# EAGLE design ATMEGA版メイン基板 (EAGLE 9.6.2)
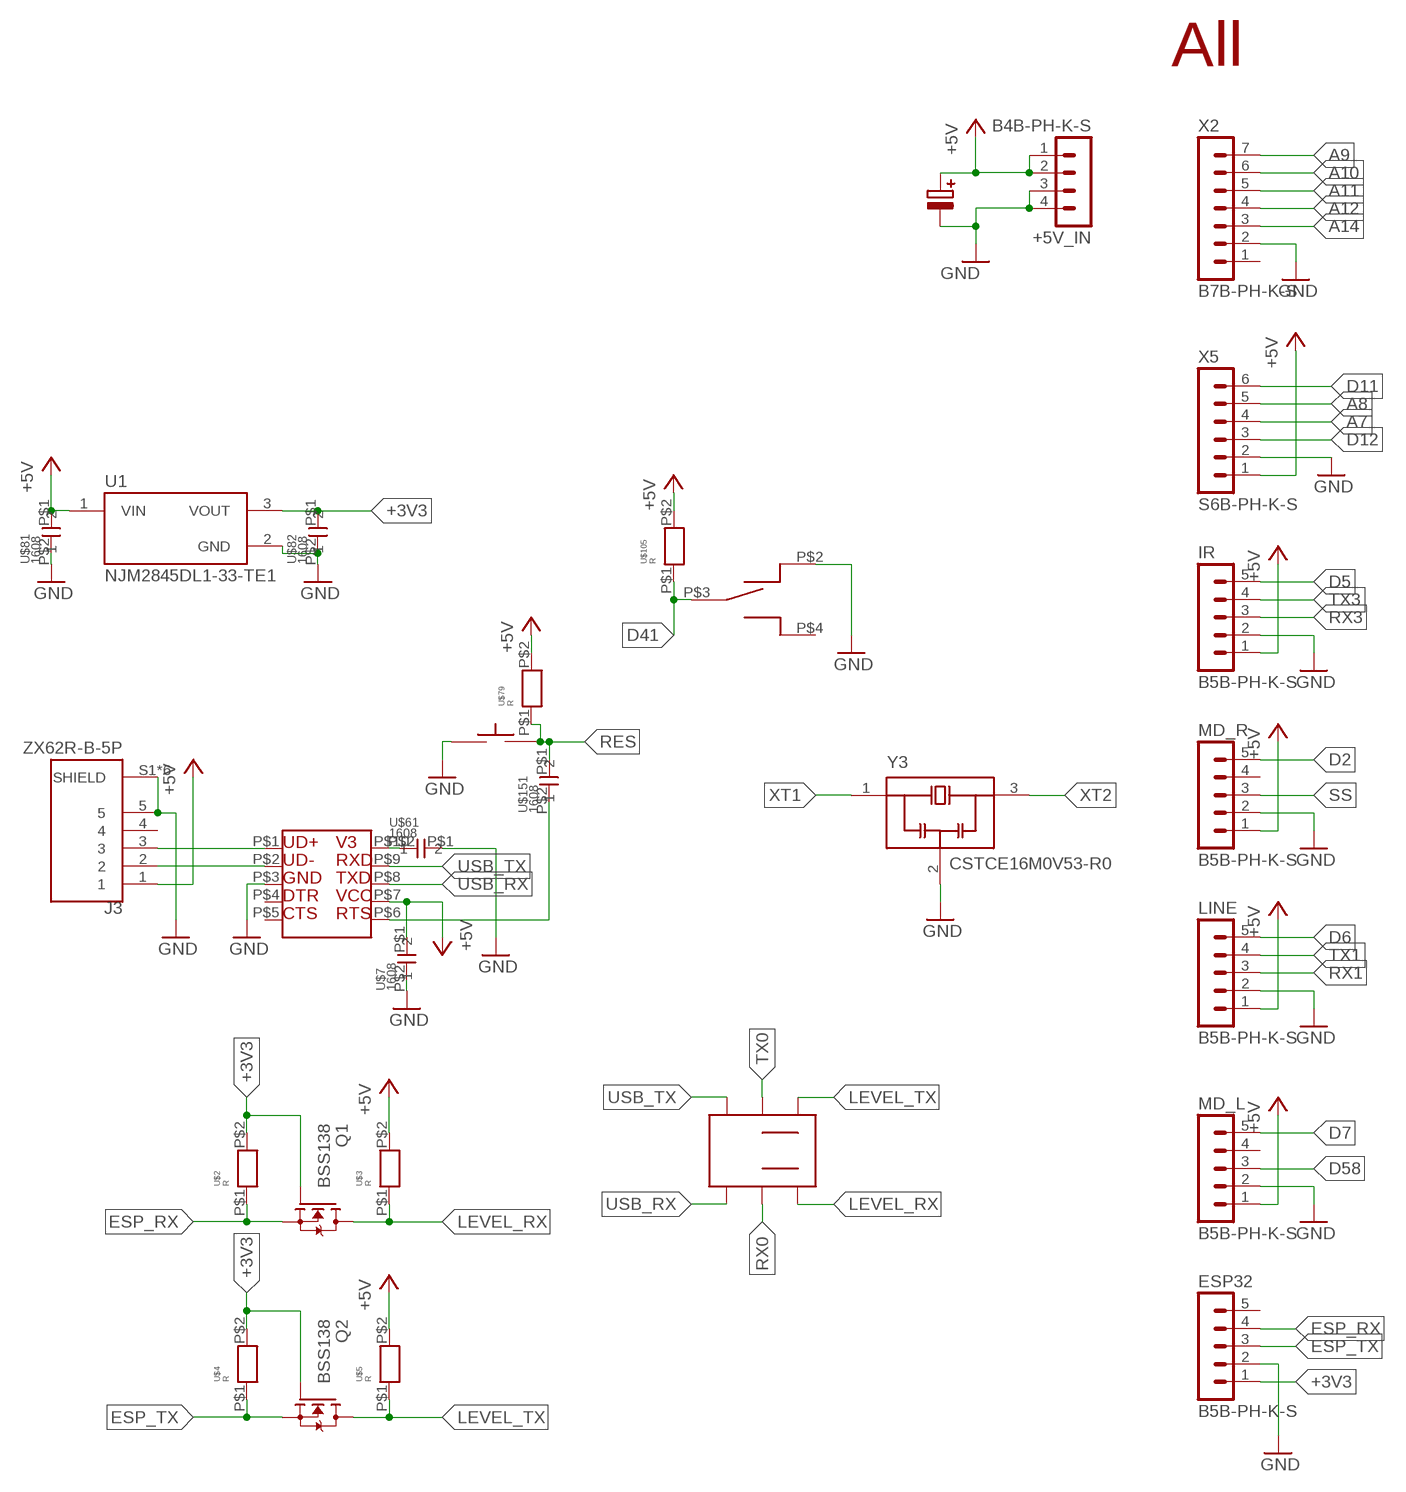
[diagram p0: schematic, sheet 1, part 1 of 2]
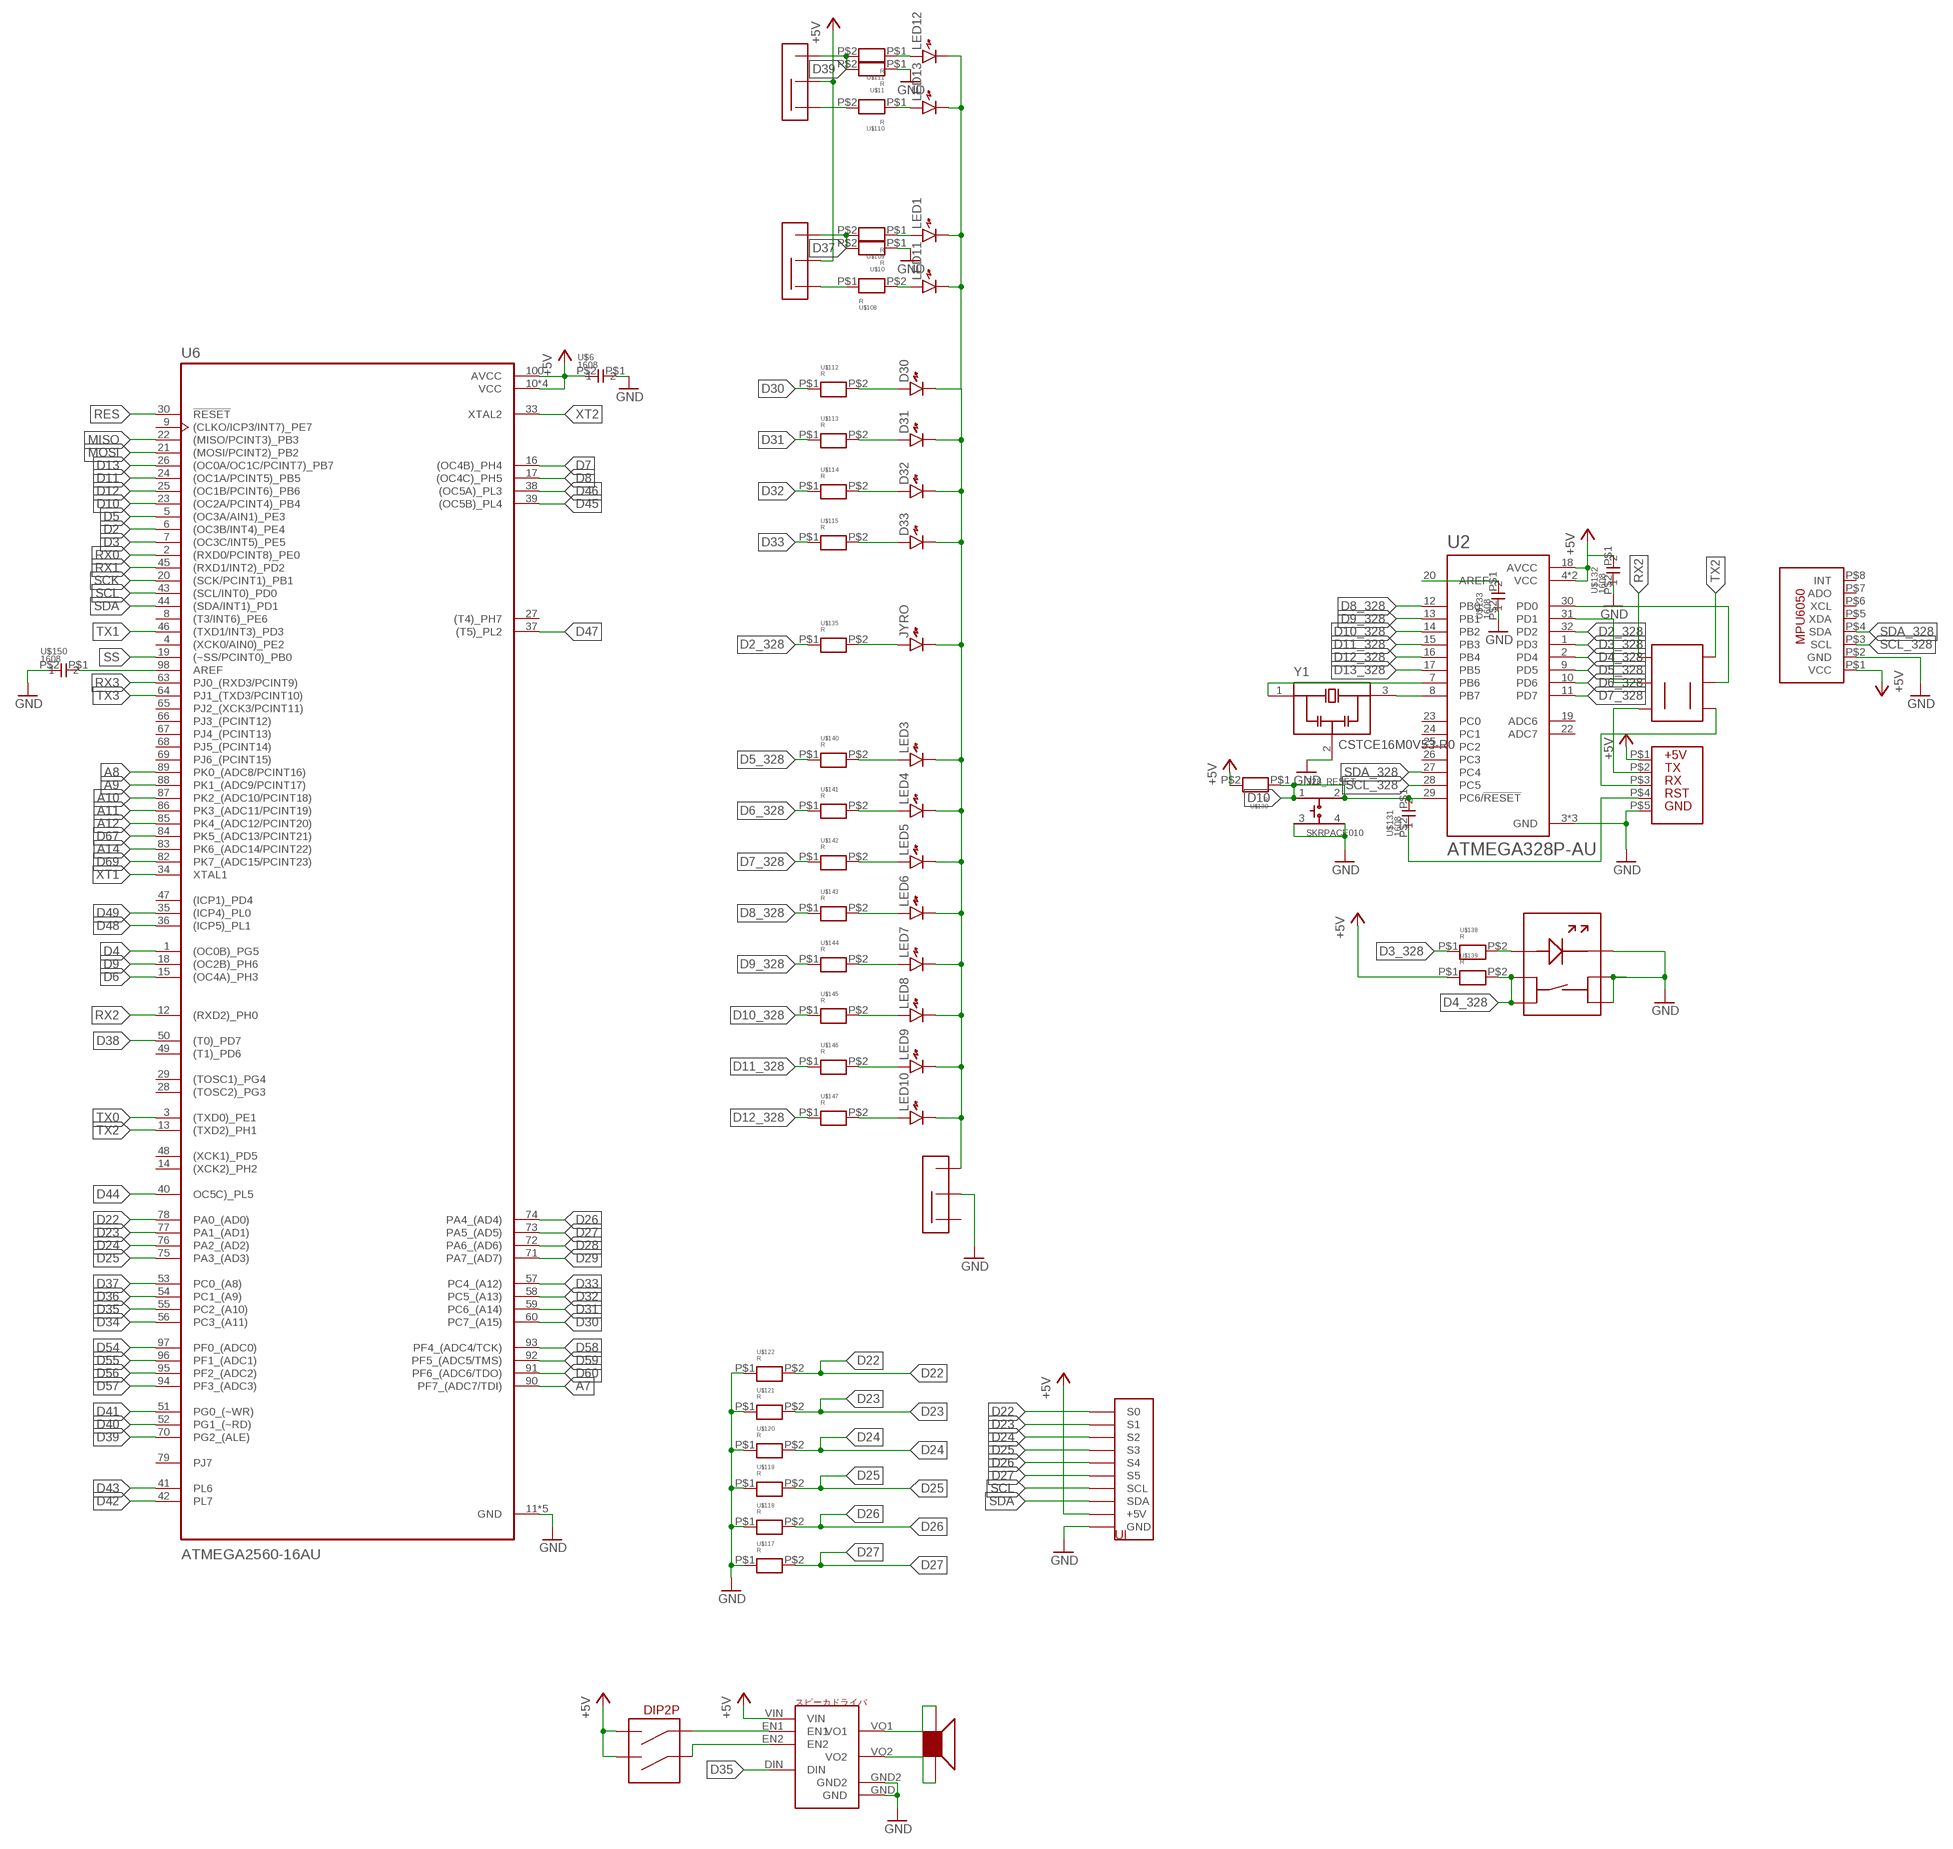
[diagram p1: schematic, sheet 1, part 2 of 2]

## Parts
328_RESET  SKRPACE010  [SW_SKRPACE010]
+5V_IN  B4B-PH-K-S  [B4B-PH-K-S]
D30  LED1608  [LED1608]
D31  LED1608  [LED1608]
D32  LED1608  [LED1608]
D33  LED1608  [LED1608]
ESP32  B5B-PH-K-S  [B5B-PH-K-S]
IR  B5B-PH-K-S  [B5B-PH-K-S]
J3  ZX62R-B-5P  [HRS_ZX62R-B-5P]
JYRO  LED1608  [LED1608]
LED1  LED1608  [LED1608]
LED3  LED1608  [LED1608]
LED4  LED1608  [LED1608]
LED5  LED1608  [LED1608]
LED6  LED1608  [LED1608]
LED7  LED1608  [LED1608]
LED8  LED1608  [LED1608]
LED9  LED1608  [LED1608]
LED10  LED1608  [LED1608]
LED11  LED1608  [LED1608]
LED12  LED1608  [LED1608]
LED13  LED1608  [LED1608]
LINE  B5B-PH-K-S  [B5B-PH-K-S]
MD_L  B5B-PH-K-S  [B5B-PH-K-S]
MD_R  B5B-PH-K-S  [B5B-PH-K-S]
Q1  BSS138  [SOT23]
Q2  BSS138  [SOT23]
U1  NJM2845DL1-33-TE1  [DPAK228P968X238-4N]
U2  ATMEGA328P-AU  [QFP80P900X900X120-32N]
U6  ATMEGA2560-16AU  [QFP50P1600X1600X120-100N]
U$1  25V100  [25V100]
U$2  R  [1608]
U$3  R  [1608]
U$4  R  [1608]
U$5  R  [1608]
U$6  1608  [CON]
U$7  1608  [CON]
U$8  2SW  [2SW]
U$9  S  [S]
U$10  R  [1608]
U$11  R  [1608]
U$12  BUZA-  [ぶざー]
U$13  BUZA_DR  [BUZA_DR]
U$14  DIP2  [DIP2]
U$46  CH340K  [CH340K]
U$61  1608  [CON]
U$79  R  [1608]
U$80  TAKUTO  [12]
U$81  1608  [CON]
U$82  1608  [CON]
U$93  ジャイロ  [ジャイロ]
U$105  R  [1608]
U$106  SSW  [SSW]
U$107  SSW  [SSW]
U$108  R  [1608]
U$109  R  [1608]
U$110  R  [1608]
U$111  R  [1608]
U$112  R  [1608]
U$113  R  [1608]
U$114  R  [1608]
U$115  R  [1608]
U$117  R  [1608]
U$118  R  [1608]
U$119  R  [1608]
U$120  R  [1608]
U$121  R  [1608]
U$122  R  [1608]
U$130  R  [1608]
U$131  1608  [CON]
U$132  1608  [CON]
U$133  1608  [CON]
U$134  SI  [SI]
U$135  R  [1608]
U$136  2SW  [2SW]
U$137  SWLED  [SWLED]
U$138  R  [1608]
U$139  R  [1608]
U$140  R  [1608]
U$141  R  [1608]
U$142  R  [1608]
U$143  R  [1608]
U$144  R  [1608]
U$145  R  [1608]
U$146  R  [1608]
U$147  R  [1608]
U$148  SSW  [SSW]
U$149  UI  [UI]
U$150  1608  [CON]
U$151  1608  [CON]
U$152  ALL  [ALL]
X2  B7B-PH-K-S  [B7B-PH-K-S]
X5  S6B-PH-K-S  [S6B-PH-K-S]
Y1  CSTCE16M0V53-R0  [OSC_CSTCE16M0V53-R0]
Y3  CSTCE16M0V53-R0  [OSC_CSTCE16M0V53-R0]

## Nets
+3V3: ESP32.1 Q1.1(G) Q2.1(G) U1.3(VOUT) U$2.P$2 U$4.P$2 U$82.P$1
+5V: +5V_IN.1 +5V_IN.2 IR.1 J3.1 LINE.1 MD_L.1 MD_R.1 U1.1(VIN) U2.4(VCC) U2.6(VCC) U2.18(AVCC) U6.10(VCC) U6.31(VCC) U6.61(VCC) U6.80(VCC) U6.100(AVCC) U$1.P$1 U$3.P$2 U$5.P$2 U$6.P$2 U$7.P$1 U$13.VIN U$14.P$15 U$14.P$16 U$46.P$7 U$79.P$2 U$81.P$1 U$93.P$1(VCC) U$105.P$2 U$106.P$3 U$107.P$3 U$130.P$2 U$132.P$1 U$134.P$1 U$139.P$1 U$149.P$1(+5V) X5.1
A7: U6.90(PF7_(ADC7/TDI)) X5.4
A8: U6.89(PK0_(ADC8/PCINT16)) X5.5
A9: U6.88(PK1_(ADC9/PCINT17)) X2.7
A10: U6.87(PK2_(ADC10/PCINT18)) X2.6
A11: U6.86(PK3_(ADC11/PCINT19)) X2.5
A12: U6.85(PK4_(ADC12/PCINT20)) X2.4
A14: U6.83(PK6_(ADC14/PCINT22)) X2.3
D2: MD_R.5 U6.6((OC3B/INT4)_PE4)
D2_328: U2.32(PD2) U$135.P$1
D3: U6.7((OC3C/INT5)_PE5)
D3_328: U2.1(PD3) U$138.P$1
D4: U6.1((OC0B)_PG5)
D4_328: U2.2(PD4) U$137.1 U$137.2 U$139.P$2
D5: IR.5 U6.5((OC3A/AIN1)_PE3)
D5_328: U2.9(PD5) U$140.P$1
D6: LINE.5 U6.15((OC4A)_PH3)
D6_328: U2.10(PD6) U$141.P$1
D7: MD_L.5 U6.16((OC4B)_PH4)
D7_328: U2.11(PD7) U$142.P$1
D8: U6.17((OC4C)_PH5)
D8_328: U2.12(PB0) U$143.P$1
D9: U6.18((OC2B)_PH6)
D9_328: U2.13(PB1) U$144.P$1
D10: 328_RESET.1 328_RESET.2 U2.29(PC6/!RESET) U6.23((OC2A/PCINT4)_PB4) U$130.P$1 U$131.P$1
D10_328: U2.14(PB2) U$145.P$1
D11: U6.24((OC1A/PCINT5)_PB5) X5.6
D11_328: U2.15(PB3) U$146.P$1
D12: U6.25((OC1B/PCINT6)_PB6) X5.3
D12_328: U2.16(PB4) U$147.P$1
D13: U6.26((OC0A/OC1C/PCINT7)_PB7)
D13_328: U2.17(PB5)
D22: U6.78(PA0_(AD0)) U$122.P$2 U$149.P$3(S0)
D23: U6.77(PA1_(AD1)) U$121.P$2 U$149.P$4(S1)
D24: U6.76(PA2_(AD2)) U$120.P$2 U$149.P$5(S2)
D25: U6.75(PA3_(AD3)) U$119.P$2 U$149.P$6(S3)
D26: U6.74(PA4_(AD4)) U$118.P$2 U$149.P$7(S4)
D27: U6.73(PA5_(AD5)) U$117.P$2 U$149.P$8(S5)
D28: U6.72(PA6_(AD6))
D29: U6.71(PA7_(AD7))
D30: U6.60(PC7_(A15)) U$112.P$1
D31: U6.59(PC6_(A14)) U$113.P$1
D32: U6.58(PC5_(A13)) U$114.P$1
D33: U6.57(PC4_(A12)) U$115.P$1
D34: U6.56(PC3_(A11))
D35: U6.55(PC2_(A10)) U$13.DIN
D36: U6.54(PC1_(A9))
D37: U6.53(PC0_(A8)) U$10.P$2 U$106.P$2 U$109.P$2
D38: U6.50((T0)_PD7)
D39: U6.70(PG2_(ALE)) U$11.P$2 U$107.P$2 U$111.P$2
D40: U6.52(PG1_(~RD))
D41: U6.51(PG0_(~WR)) U$9.P$3 U$105.P$1
D42: U6.42(PL7)
D43: U6.41(PL6)
D44: U6.40(OC5C)_PL5)
D45: U6.39((OC5B)_PL4)
D46: U6.38((OC5A)_PL3)
D47: U6.37((T5)_PL2)
D48: U6.36((ICP5)_PL1)
D49: U6.35((ICP4)_PL0)
D54: U6.97(PF0_(ADC0))
D55: U6.96(PF1_(ADC1))
D56: U6.95(PF2_(ADC2))
D57: U6.94(PF3_(ADC3))
D58: MD_L.3 U6.93(PF4_(ADC4/TCK))
D59: U6.92(PF5_(ADC5/TMS))
D60: U6.91(PF6_(ADC6/TDO))
D67: U6.84(PK5_(ADC13/PCINT21))
D69: U6.82(PK7_(ADC15/PCINT23))
ESP_RX: ESP32.4 Q1.2(S) U$2.P$1
ESP_TX: ESP32.3 Q2.2(S) U$4.P$1
GND: 328_RESET.3 328_RESET.4 +5V_IN.3 +5V_IN.4 ESP32.2 IR.2 J3.5 J3.S1(SHIELD) J3.S2(SHIELD) J3.S3(SHIELD) J3.S4(SHIELD) J3.S5(SHIELD) J3.S6(SHIELD) LINE.2 MD_L.2 MD_R.2 U1.2(GND) U2.3(GND) U2.5(GND) U2.21(GND) U6.11(GND) U6.32(GND) U6.62(GND) U6.81(GND) U6.99(GND) U$1.P$2 U$6.P$1 U$7.P$2 U$9.P$2 U$10.P$1 U$11.P$1 U$13.GND U$13.GND2 U$46.P$3 U$61.P$1 U$80.P$1 U$80.P$4 U$81.P$2 U$82.P$2 U$93.P$2(GND) U$117.P$1 U$118.P$1 U$119.P$1 U$120.P$1 U$121.P$1 U$122.P$1 U$132.P$2 U$133.P$2 U$134.P$5 U$137.3 U$137.4 U$137.-(LED-) U$148.P$3 U$149.P$2(GND) U$150.P$2 X2.2 X5.2 Y1.2(GND) Y3.2(GND)
LEVEL_RX: Q1.3(D) U$3.P$1 U$8.P$1
LEVEL_TX: Q2.3(D) U$5.P$1 U$8.P$6
MISO: U6.22((MISO/PCINT3)_PB3)
MOSI: U6.21((MOSI/PCINT2)_PB2)
N$1: U$12.P$2 U$13.VO2
N$2: J3.2 U$46.P$2
N$3: J3.3 U$46.P$1
N$4: U$46.P$10 U$61.P$2
N$5: D30.K D31.K D32.K D33.K JYRO.K LED1.K LED3.K LED4.K LED5.K LED6.K LED7.K LED8.K LED9.K LED10.K LED11.K LED12.K LED13.K U$148.P$2
N$6: LED12.A U$111.P$1
N$7: LED13.A U$110.P$1
N$8: U$107.P$1 U$110.P$2
N$9: U$106.P$1 U$108.P$1
N$10: LED11.A U$108.P$2
N$11: LED1.A U$109.P$1
N$12: U$12.P$1 U$13.VO1
N$13: U$13.EN2 U$14.P$1
N$14: U$13.EN1 U$14.P$2
N$65: D30.A U$112.P$2
N$66: D31.A U$113.P$2
N$67: D32.A U$114.P$2
N$68: D33.A U$115.P$2
N$69: U2.20(AREF) U$133.P$1
N$70: U$131.P$2 U$134.P$4
N$71: U2.31(PD1) U$136.P$2
N$72: U2.8(PB7) Y1.3(OUT)
N$73: U2.7(PB6) Y1.1(IN)
N$74: JYRO.A U$135.P$2
N$75: U2.30(PD0) U$136.P$5
N$76: U$134.P$3 U$136.P$6
N$77: U$134.P$2 U$136.P$1
N$79: U$137.+(LED+) U$138.P$2
N$80: LED3.A U$140.P$2
N$81: LED4.A U$141.P$2
N$82: LED5.A U$142.P$2
N$83: LED6.A U$143.P$2
N$84: LED7.A U$144.P$2
N$85: LED8.A U$145.P$2
N$86: LED9.A U$146.P$2
N$87: LED10.A U$147.P$2
N$89: U6.98(AREF) U$150.P$1
N$90: U$46.P$6 U$151.P$2
RES: U6.30(!RESET) U$79.P$1 U$80.P$2 U$80.P$3 U$151.P$1
RX0: U6.2((RXD0/PCINT8)_PE0) U$8.P$2
RX1: LINE.3 U6.45((RXD1/INT2)_PD2)
RX2: U6.12((RXD2)_PH0) U$136.P$3
RX3: IR.3 U6.63(PJ0_(RXD3/PCINT9))
SCK [New Class]: U6.20((SCK/PCINT1)_PB1)
SCL: U6.43((SCL/INT0)_PD0) U$149.P$9(SCL)
SCL_328: U2.28(PC5) U$93.P$3(SCL)
SDA: U6.44((SDA/INT1)_PD1) U$149.P$10(SDA)
SDA_328: U2.27(PC4) U$93.P$4(SDA)
SS: MD_R.3 U6.19((~SS/PCINT0)_PB0)
TX0: U6.3((TXD0)_PE1) U$8.P$5
TX1: LINE.4 U6.46((TXD1/INT3)_PD3)
TX2: U6.13((TXD2)_PH1) U$136.P$4
TX3: IR.4 U6.64(PJ1_(TXD3/PCINT10))
USB_RX: U$8.P$3 U$46.P$8
USB_TX: U$8.P$4 U$46.P$9
XT1: U6.34(XTAL1) Y3.1(IN)
XT2: U6.33(XTAL2) Y3.3(OUT)
Unconnected: ESP32.5 J3.4 MD_L.4 MD_R.4 U2.19(ADC6) U2.22(ADC7) U2.23(PC0) U2.24(PC1) U2.25(PC2) U2.26(PC3) U6.4((XCK0/AIN0)_PE2) U6.8((T3/INT6)_PE6) U6.9((CLKO/ICP3/INT7)_PE7) U6.14((XCK2)_PH2) U6.27((T4)_PH7) U6.28((TOSC2)_PG3) U6.29((TOSC1)_PG4) U6.47((ICP1)_PD4) U6.48((XCK1)_PD5) U6.49((T1)_PD6) U6.65(PJ2_(XCK3/PCINT11)) U6.66(PJ3_(PCINT12)) U6.67(PJ4_(PCINT13)) U6.68(PJ5_(PCINT14)) U6.69(PJ6_(PCINT15)) U6.79(PJ7) U$9.P$4 U$46.P$4 U$46.P$5 U$93.P$5(XDA) U$93.P$6(XCL) U$93.P$7(ADO) U$93.P$8(INT) U$148.P$1 X2.1

## Library data of the parts
328_RESET = SKRPACE010:SKRPACE010: Switch Tactile N.O. SPST Button J-Bend 0.05A 16VDC 2.55N SMD Automotive T/R Check prices <https://pricing.snapeda.com/parts/SKRPACE010/ALPS/view-part?ref=eda>; AVAILABILITY: In Stock; DESCRIPTION: Switch Tactile N.O. SPST Button J-Bend 0.05A 16VDC 2.55N SMD Automotive T/R; MF: ALPS; MP: SKRPACE010; PACKAGE: None; PRICE: None
+5V_IN = con-JST PH:B4B-PH: JST PH series header 2.00mm pitch disconnectable crimp style connectors, vertical (side entry type), 4 pins
D30-D33 JYRO LED1 LED3-LED13 = generic:LED: Generic LEDs
ESP32 IR LINE MD_L MD_R = con-JST PH:B5B-PH: JST PH series header 2.00mm pitch disconnectable crimp style connectors, vertical (side entry type), 5 pins
J3 = USBMicro:ZX62R-B-5P: Conn Micro USB 2.0 Type B RCP 5 POS 0.65mm Solder RA SMD 5 Terminal 1 Port Embossed T/R Check prices <https://pricing.snapeda.com/parts/ZX62R-B-5P/Hirose/view-part?ref=eda>; AVAILABILITY: In Stock; DESCRIPTION: USB - micro B USB 2.0 Receptacle Connector 5 Position Surface Mount, Right Angle; MF: Hirose; MP: ZX62R-B-5P; PACKAGE: None; PRICE: None
Q1 Q2 = bss138_10:BSS138: BSS138 N-Channel Logic Level Enhancement Mode Field Effect Transistor Source: http://www.fairchildsemi.com/datasheets/BS/BSS138.pdf; MF: Fairchild; MPN: BSS138; OC_FARNELL: 9845330; OC_NEWARK: 67R2009
U1 = NJM2845DL1-33-TE1:NJM2845DL1-33-TE1: NJM2845 Series 800 mA 3.3 V Fixed Output SMT LDO Regulator - TO-252 Check prices <https://pricing.snapeda.com/parts/NJM2845DL1-33-TE1/NJR%20Corporation/NJRC/view-part?ref=eda>; AVAILABILITY: Not in stock; DESCRIPTION: Linear Voltage Regulator IC Positive Fixed 1 Output 800mA TO-252-3; MF: NJR Corporation/NJRC; MP: NJM2845DL1-33-TE1; PACKAGE: TO-252-3 New Japan Radio; PRICE: None
U2 = ATMEGA328P-AU:ATMEGA328P-AU: ATmega Series 20 MHz 32 KB Flash 2 KB SRAM 8-Bit Microcontroller - TQFP-32 Check prices <https://pricing.snapeda.com/parts/ATMEGA328P-AU/Microchip%20Technology/view-part?ref=eda>; AVAILABILITY: In Stock; DESCRIPTION: AVR AVR® ATmega Microcontroller IC 8-Bit 20MHz 32KB (16K x 16) FLASH 32-TQFP (7x7); MF: Microchip Technology; MP: ATMEGA328P-AU; PACKAGE: TQFP-32 Microchip; PRICE: None
U6 = ATMEGA2560-16AU (1):ATMEGA2560-16AU: Check prices <https://pricing.snapeda.com/parts/ATMEGA2560-16AU/Microchip%20Technology/view-part?ref=eda>; AVAILABILITY: In Stock; DESCRIPTION: AVR AVR® ATmega Microcontroller IC 8-Bit 16MHz 256KB (128K x 16) FLASH 100-TQFP (14x14); MF: Microchip Technology; MP: ATMEGA2560-16AU; PACKAGE: None; PRICE: None; PURCHASE-URL: https://pricing.snapeda.com/search/part/ATMEGA2560-16AU/?ref=eda
U$1 = 100uF25V 電解:25V100
U$2-U$5 U$10 U$11 U$79 U$105 U$108-U$115 U$117-U$122 U$130 U$135 U$138-U$147 = R 1608:R
U$6 U$7 U$61 U$81 U$82 U$131-U$133 U$150 U$151 = con1608:1608
U$8 U$136 = 2SW:2SW
U$9 = トグル:S
U$12 = ブザー:BUZA-
U$13 = ブザードライバ:BUZA_DR
U$14 = 8P_DIPSW - コピー:DIP2
U$46 = CH340K:CH340K
U$80 = タクト:TAKUTO
U$93 = ジャイロセンサ:ジャイロ
U$106 U$107 U$148 = SSW:SSW
U$134 = プログラム入力:SI
U$137 = SW_LED:SWLED
U$149 = UI:UI
U$152 = All_outlook:ALL
X2 = con-JST PH:B7B-PH: JST PH series header 2.00mm pitch disconnectable crimp style connectors, vertical (side entry type), 7 pins
X5 = con-JST PH:S6B-PH: JST PH series header 2.00mm pitch disconnectable crimp style connectors, horizontal (side entry type), 6 pins
Y1 Y3 = CSTCE16M0V53-R0:CSTCE16M0V53-R0: 20MHz Ceramic Resonator Built in Capacitor 15pF +/- 0.2% -40C - 125C Surface Mount; MANUFACTURER: Murata; MAXIMUM_PACKAGE_HEIGHT: 1.00mm; PARTREV: May 7, 2019; STANDARD: Manufacturer Recommendations

## Board
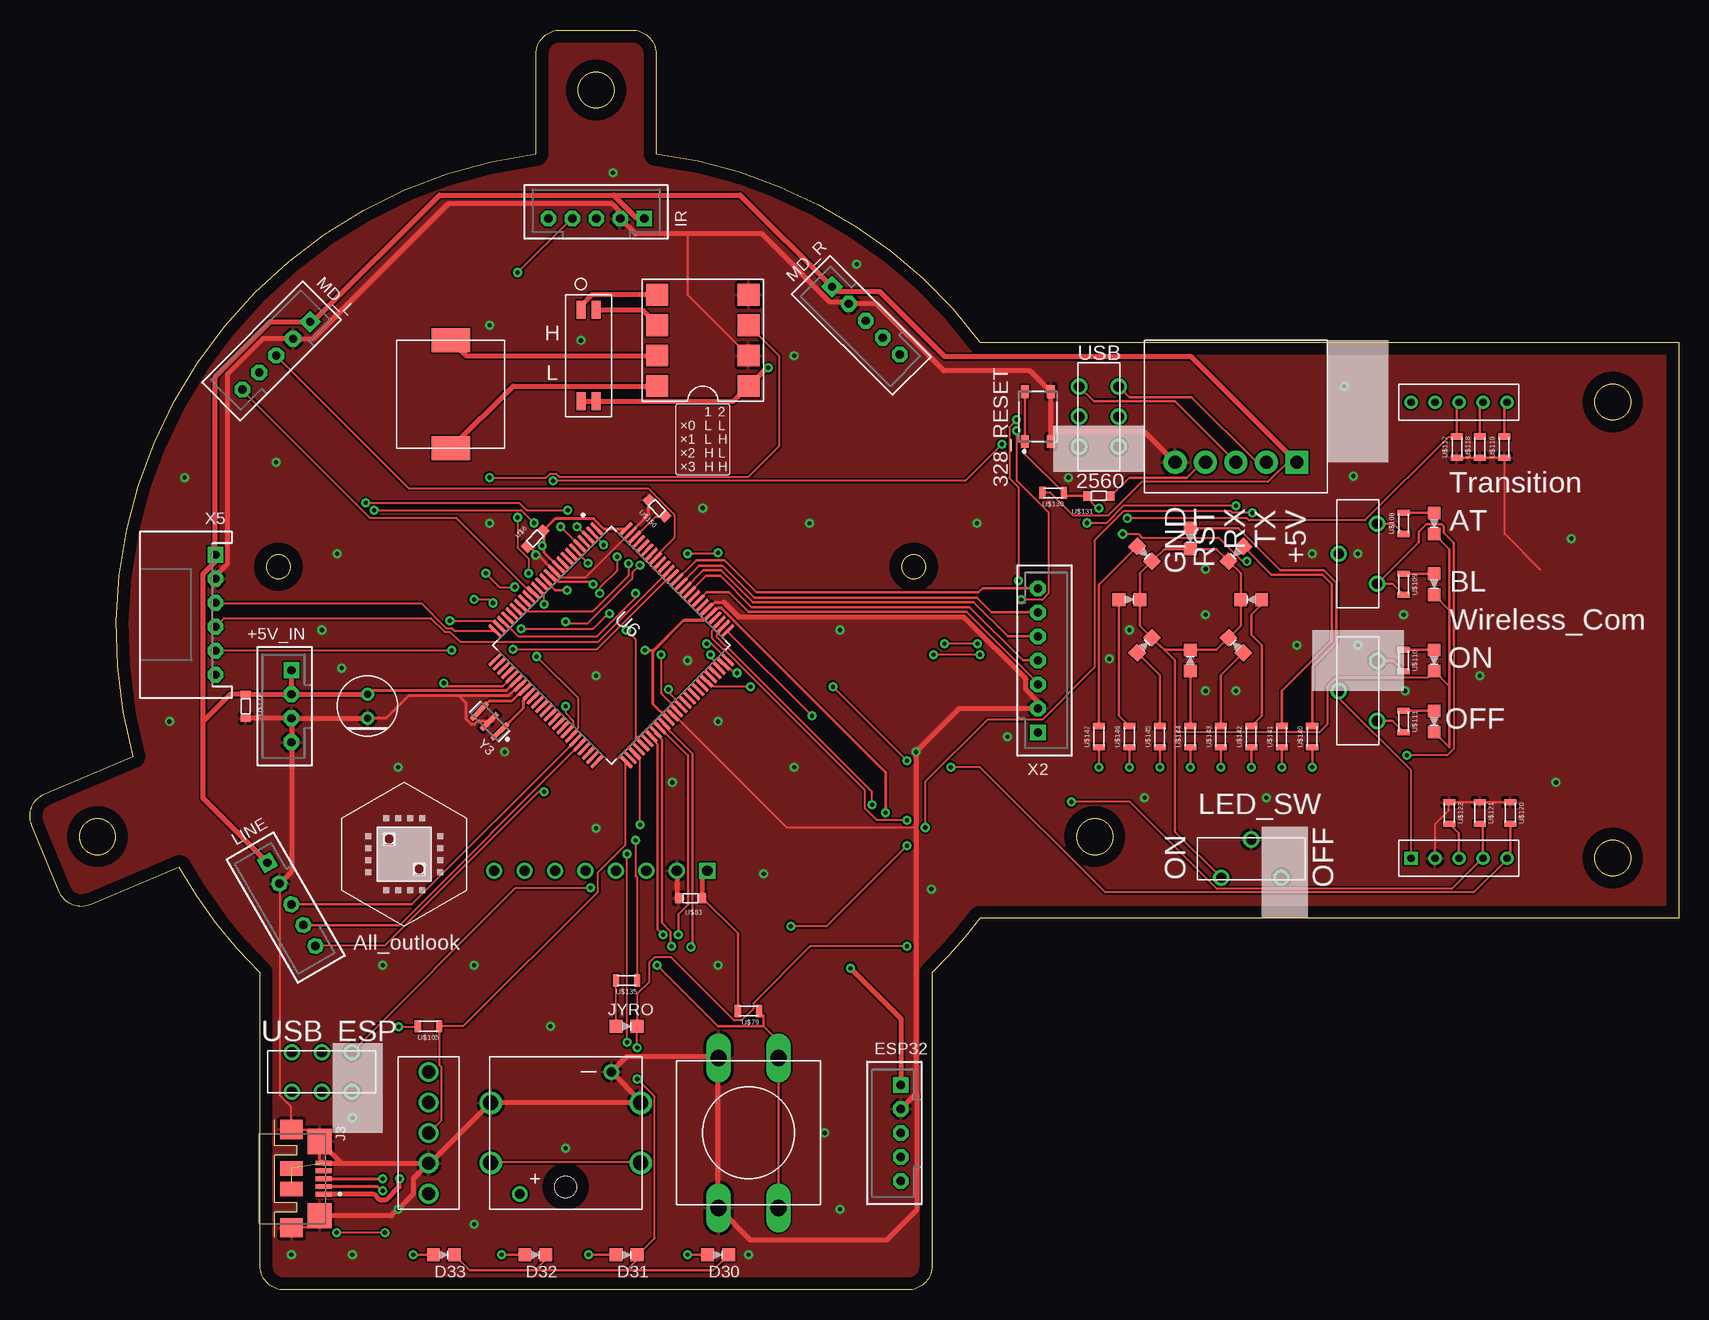
[diagram p2: board, top side]
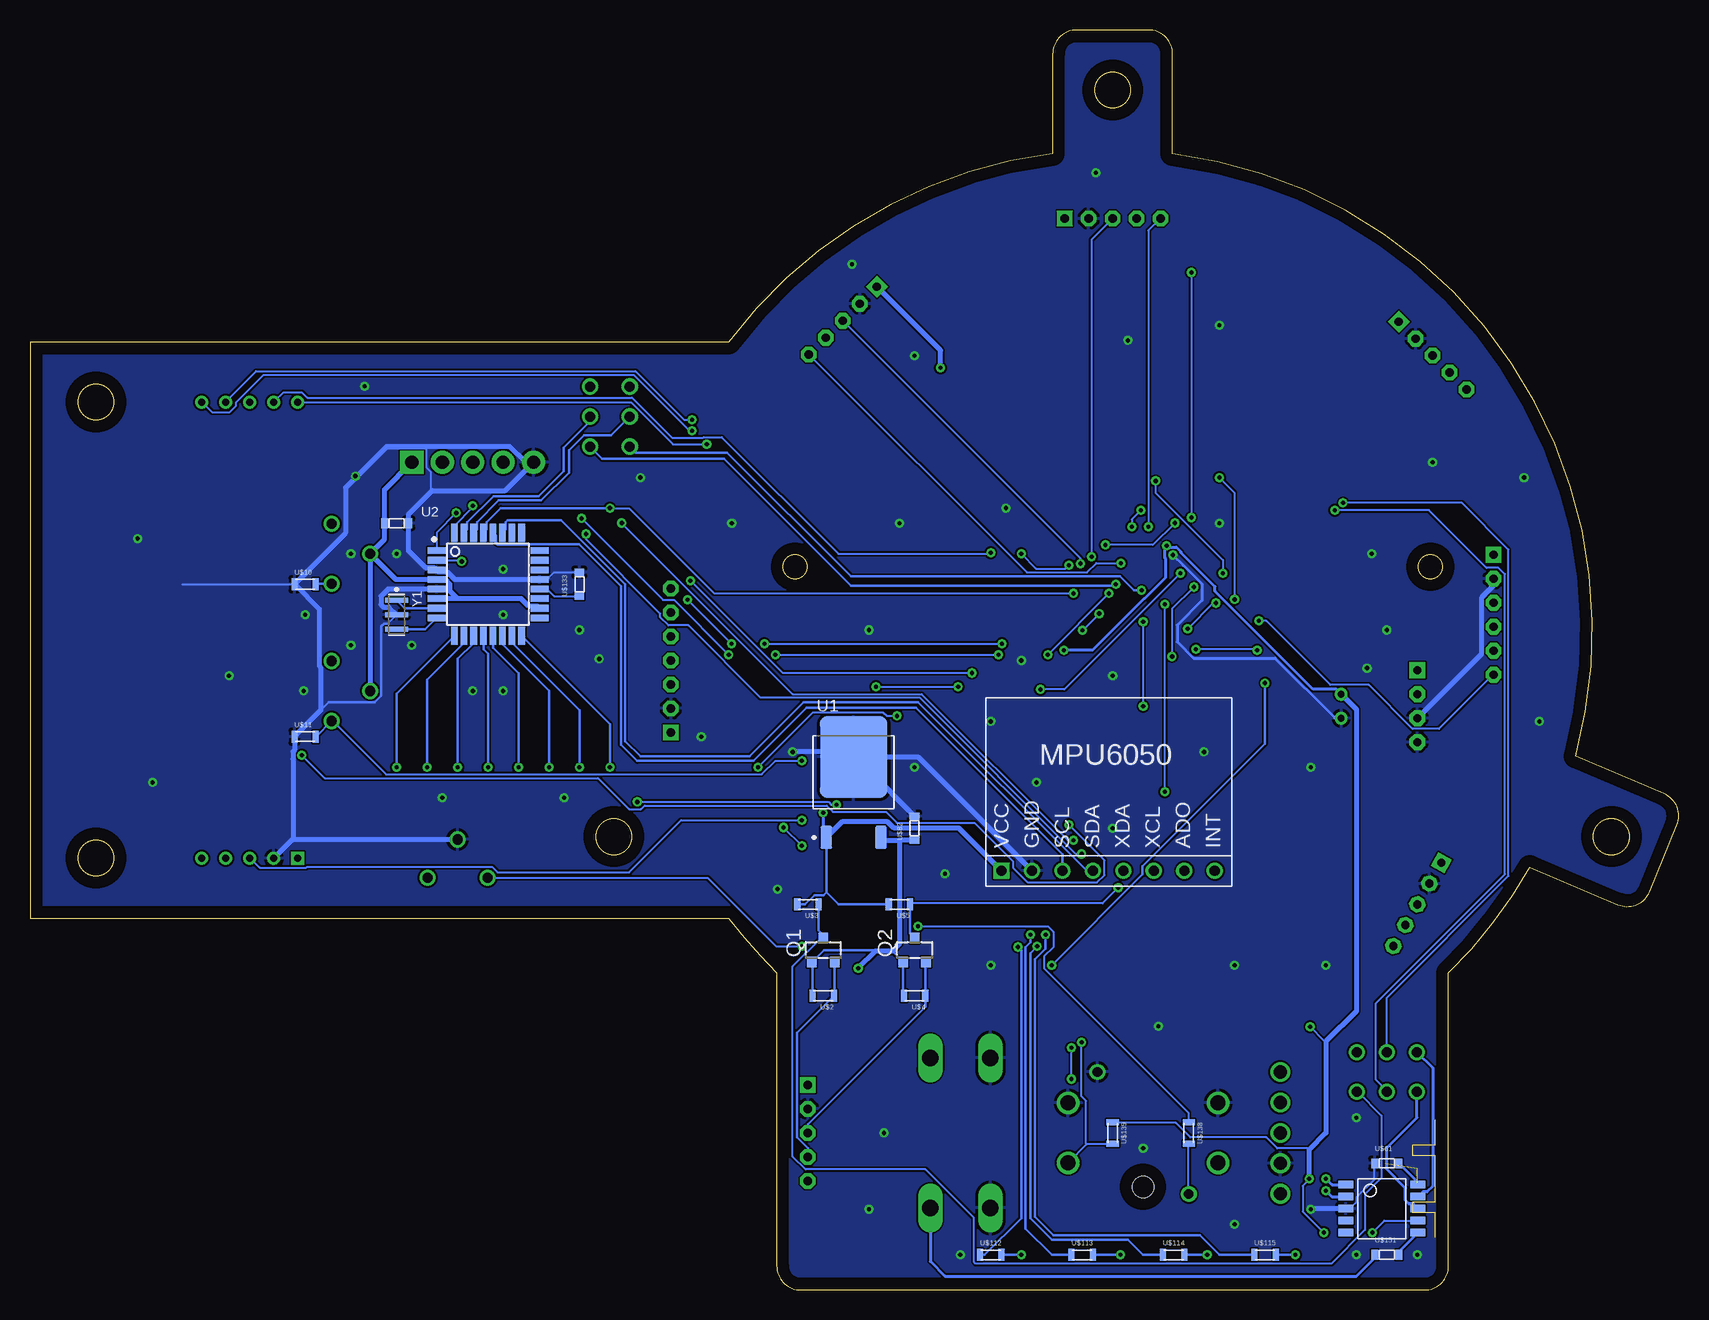
[diagram p3: board, bottom side, seen from below]

Size 137.44 x 105 mm. Coordinates in mm from the lower left corner, seen from the top.
Outline: 8.6,44.47 arc-98 42.19,94.68 42.19,103 arc-90 44.19,105 50.19,105 arc-90 52.19,103 52.19,94.68 arc-46 79.19,79 137.44,79 137.44,31 79.19,31 arc-9 75.19,26.43 75.19,2 arc-90 73.19,0 21.19,0 arc-90 19.19,2 19.19,26.43 arc-16 12.42,35.23 5.07,32.11 arc-91 2.44,33.19 0.15,38.74 arc-89 1.22,41.34 8.6,44.47
Outline: circle at 5.62,37.78 radius 1.5
Outline: circle at 131.94,36 radius 1.5
Outline: circle at 131.94,74 radius 1.5
Outline: circle at 73.67,60.26 radius 1
Outline: circle at 20.71,60.26 radius 1
Outline: circle at 88.77,37.78 radius 1.5
Outline: circle at 47.19,100 radius 1.5
Copper layers (1*16): Top 0.035mm / dielectric 1.5mm / Bottom 0.035mm
Design rules "default": minimum track width 6mil, minimum drill 0.35mm, track to track 6mil, track to pad 6mil, pad to pad 6mil, via to via 6mil, smd to smd 6mil, copper to edge 40mil, drill to drill 6mil, minimum pad ring 10mil, minimum via ring 8mil, stop-mask expansion 4mil, vias tented up to drill 0mil, thermal gap 10mil

### Footprints (pad centres in the part's own frame; a part is rotated, then mirrored left to right if it is on the bottom)
SW_SKRPACE010 = smd 1.05 x 0.65: 1 -2.075,1.075; 2 2.075,1.075; 3 -2.075,-1.075; 4 2.075,-1.075
B4B-PH-K-S = drill 0.7 pad 1.3 square: 1 3,0 | drill 0.7 pad 1.3 octagon: 2 1,0; 3 -1,0; 4 -3,0
LED1608 = smd 1.05 x 1.08: A -0.875,0; K 0.875,0
B5B-PH-K-S = drill 0.7 pad 1.3 square: 1 4,0 | drill 0.7 pad 1.3 octagon: 2 2,0; 3 0,0; 4 -2,0; 5 -4,0
HRS_ZX62R-B-5P = smd 0.4 x 1.35: 1 1.3,2.675; 2 0.65,2.675; 3 0,2.675; 4 -0.65,2.675; 5 -1.3,2.675 | smd 2.1 x 2: S1 -3.1,2.35; S2 3.1,2.35 | smd 1.6 x 1.9: S3 -4.1,0; S4 4.1,0 | smd 1.2 x 1.9: S5 -0.85,0; S6 0.85,0
SOT23 = smd 0.8 x 0.9: 1 -0.95,-1; 2 0.95,-1; 3 0,1
DPAK228P968X238-4N = smd 0.96 x 1.9: 1 -2.28,-4.59; 3 2.28,-4.59 | smd 5.63 x 6.84: 2 0,2.12
QFP80P900X900X120-32N = smd 1.5 x 0.55: 1 -4.3,2.8; 2 -4.3,2; 3 -4.3,1.2; 4 -4.3,0.4; 5 -4.3,-0.4; 6 -4.3,-1.2; 7 -4.3,-2; 8 -4.3,-2.8; 17 4.3,-2.8; 18 4.3,-2; 19 4.3,-1.2; 20 4.3,-0.4; 21 4.3,0.4; 22 4.3,1.2; 23 4.3,2; 24 4.3,2.8 | smd 0.55 x 1.5: 9 -2.8,-4.3; 10 -2,-4.3; 11 -1.2,-4.3; 12 -0.4,-4.3; 13 0.4,-4.3; 14 1.2,-4.3; 15 2,-4.3; 16 2.8,-4.3; 25 2.8,4.3; 26 2,4.3; 27 1.2,4.3; 28 0.4,4.3; 29 -0.4,4.3; 30 -1.2,4.3; 31 -2,4.3; 32 -2.8,4.3
QFP50P1600X1600X120-100N = smd 1.47 x 0.28: 1 -7.67,6; 2 -7.67,5.5; 3 -7.67,5; 4 -7.67,4.5; 5 -7.67,4; 6 -7.67,3.5; 7 -7.67,3; 8 -7.67,2.5; 9 -7.67,2; 10 -7.67,1.5; 11 -7.67,1; 12 -7.67,0.5; 13 -7.67,0; 14 -7.67,-0.5; 15 -7.67,-1; 16 -7.67,-1.5; 17 -7.67,-2; 18 -7.67,-2.5; 19 -7.67,-3; 20 -7.67,-3.5; 21 -7.67,-4; 22 -7.67,-4.5; 23 -7.67,-5; 24 -7.67,-5.5; 25 -7.67,-6; 51 7.67,-6; 52 7.67,-5.5; 53 7.67,-5; 54 7.67,-4.5; 55 7.67,-4; 56 7.67,-3.5; 57 7.67,-3; 58 7.67,-2.5; 59 7.67,-2; 60 7.67,-1.5; 61 7.67,-1; 62 7.67,-0.5; 63 7.67,0; 64 7.67,0.5; 65 7.67,1; 66 7.67,1.5; 67 7.67,2; 68 7.67,2.5; 69 7.67,3; 70 7.67,3.5; 71 7.67,4; 72 7.67,4.5; 73 7.67,5; 74 7.67,5.5; 75 7.67,6 | smd 0.28 x 1.47: 26 -6,-7.67; 27 -5.5,-7.67; 28 -5,-7.67; 29 -4.5,-7.67; 30 -4,-7.67; 31 -3.5,-7.67; 32 -3,-7.67; 33 -2.5,-7.67; 34 -2,-7.67; 35 -1.5,-7.67; 36 -1,-7.67; 37 -0.5,-7.67; 38 0,-7.67; 39 0.5,-7.67; 40 1,-7.67; 41 1.5,-7.67; 42 2,-7.67; 43 2.5,-7.67; 44 3,-7.67; 45 3.5,-7.67; 46 4,-7.67; 47 4.5,-7.67; 48 5,-7.67; 49 5.5,-7.67; 50 6,-7.67; 76 6,7.67; 77 5.5,7.67; 78 5,7.67; 79 4.5,7.67; 80 4,7.67; 81 3.5,7.67; 82 3,7.67; 83 2.5,7.67; 84 2,7.67; 85 1.5,7.67; 86 1,7.67; 87 0.5,7.67; 88 0,7.67; 89 -0.5,7.67; 90 -1,7.67; 91 -1.5,7.67; 92 -2,7.67; 93 -2.5,7.67; 94 -3,7.67; 95 -3.5,7.67; 96 -4,7.67; 97 -4.5,7.67; 98 -5,7.67; 99 -5.5,7.67; 100 -6,7.67
25V100 = drill 0.55: P$1 -1,0; P$2 1,0
1608 = smd 0.508 x 1.016: P$1 -0.889,0; P$2 0.889,0
CON = smd 0.6 x 0.813: P$1 -1,0; P$2 1,0
2SW = drill 0.85: P$1 -2.5,1.65; P$2 0,1.65; P$3 2.5,1.65; P$4 2.5,-1.65; P$5 0,-1.65; P$6 -2.5,-1.65
S = drill 1.1: P$1 0,-5.08; P$2 0,-2.54; P$3 0,0; P$4 0,2.54; P$5 0,5.08
ぶざー = smd 3.2 x 2: P$1 4.5,9; P$2 4.5,0
BUZA_DR = smd 1.8 x 1.8: DIN 5.08,0; EN1 5.08,7.62; EN2 7.62,7.62; GND 2.54,0; GND2 7.62,0; VIN 0,0; VO1 0,7.62; VO2 2.54,7.62
DIP2 = smd 0.76 x 1.5: P$1 0,7.62; P$2 1.27,7.62; P$15 1.27,0; P$16 0,0
CH340K = smd 0.635 x 1.27: P$1 0.5,-1; P$2 1.5,-1; P$3 2.5,-1; P$4 3.5,-1; P$5 4.5,-1; P$6 4.5,5; P$7 3.5,5; P$8 2.5,5; P$9 1.5,5; P$10 0.5,5
12 = drill 1.35 long: P$1 -6.25,2.5; P$2 -6.25,-2.5; P$3 6.25,-2.5; P$4 6.25,2.5
ジャイロ = drill 0.85 square: P$1 1.27,1.27 | drill 0.85: P$2 3.81,1.27; P$3 6.35,1.27; P$4 8.89,1.27; P$5 11.43,1.27; P$6 13.97,1.27; P$7 16.51,1.27; P$8 19.05,1.27
SSW = drill 0.85: P$1 -2.5,1.6; P$2 2.5,1.6; P$3 0,-1.6
SI = drill 1.1 pad 1.93 square: P$1 -7.62,0 | drill 1.1 pad 1.93: P$2 -5.08,0; P$3 -2.54,0; P$4 0,0; P$5 2.54,0
SWLED = drill 1.25: 1 -6.25,-2.5; 2 6.25,-2.5; 3 -6.25,2.5; 4 6.25,2.5 | drill 0.8: + -3.81,-5.08; - 3.81,5.08 | hole 1.8: 0,-4.5
UI = drill 0.6 square: P$1 1,-1.5 | drill 0.6: P$2 3,-1.5; P$3 5,-1.5; P$4 7,-1.5; P$5 9,-1.5; P$6 9,36.5; P$7 7,36.5; P$8 5,36.5; P$9 3,36.5; P$10 1,36.5
B7B-PH-K-S = drill 0.7 pad 1.3 square: 1 6,0 | drill 0.7 pad 1.3 octagon: 2 4,0; 3 2,0; 4 0,0; 5 -2,0; 6 -4,0; 7 -6,0
S6B-PH-K-S = drill 0.7 pad 1.3 square: 1 5,0 | drill 0.7 pad 1.3 octagon: 2 3,0; 3 1,0; 4 -1,0; 5 -3,0; 6 -5,0
OSC_CSTCE16M0V53-R0 = smd 0.4 x 1.9: 1 -1.2,0; 2 0,0; 3 1.2,0

### Placement (x,y rotation side)
328_RESET  84.02,72.78 90 top
+5V_IN  21.79,48.65 90 top
D30  57.35,2.93 0 top
D31  49.73,2.93 0 top
D32  42.11,2.93 0 top
D33  34.49,2.93 0 top
ESP32  72.59,13.09 90 top
IR  47.19,89.29 0 top
J3  21.79,9.28 270 top
JYRO  49.73,21.98 0 top
LED1  117.04,58.81 270 top
LED3  96.72,62.62 270 top
LED4  100.53,61.35 225 top
LED5  101.8,57.54 180 top
LED6  100.53,53.73 135 top
LED7  96.72,52.46 90 top
LED8  92.91,53.73 45 top
LED9  91.64,57.54 0 top
LED10  92.91,61.35 315 top
LED11  117.04,63.89 270 top
LED12  117.04,47.38 270 top
LED13  117.04,52.46 270 top
LINE  21.79,32.14 120 top
MD_L  20.52,77.86 45 top
MD_R  69.68,80.77 135 top
Q1  71.32,28.33 0 bottom
Q2  63.7,28.33 0 bottom
U1  68.78,42.3 0 bottom
U2  99.26,58.81 0 bottom
U6  48.46,53.73 315 top
U$1  28.14,48.65 270 top
U$2  71.32,24.52 180 bottom
U$3  72.59,32.14 180 bottom
U$4  63.7,24.52 180 bottom
U$5  64.97,32.14 180 bottom
U$6  42.11,62.62 45 top
U$7  106.88,63.89 0 bottom
U$8  24.33,18.17 180 top
U$9  33.22,13.09 0 top
U$10  114.5,58.81 0 bottom
U$11  114.5,46.11 0 bottom
U$12  39.57,79.13 180 top
U$13  59.89,75.32 90 top
U$14  45.92,74.05 0 top
U$46  26.74,9.28 270 bottom
U$61  24.33,10.55 0 bottom
U$79  59.89,23.25 180 top
U$80  59.89,13.09 90 top
U$81  55.07,32.64 180 top
U$82  63.7,38.49 90 bottom
U$93  57.73,33.66 0 bottom
U$105  33.22,21.98 180 top
U$106  110.69,61.35 270 top
U$107  110.69,49.92 270 top
U$108  114.5,63.89 90 top
U$109  114.5,58.81 270 top
U$110  114.5,52.46 270 top
U$111  114.5,47.38 270 top
U$112  57.35,2.93 0 bottom
U$113  49.73,2.93 0 bottom
U$114  42.11,2.93 0 bottom
U$115  34.49,2.93 0 bottom
U$117  118.95,70.24 90 top
U$118  120.85,70.24 90 top
U$119  122.88,70.24 90 top
U$120  123.39,39.76 270 top
U$121  120.85,39.76 270 top
U$122  118.31,39.76 270 top
U$130  85.29,66.43 180 top
U$131  89.1,66.17 0 top
U$132  17.98,48.65 270 top
U$133  91.64,58.81 90 bottom
U$134  97.99,68.97 180 top
U$135  49.73,25.79 180 top
U$136  89.1,72.78 270 top
U$137  44.65,13.09 0 top
U$138  40.84,13.09 270 bottom
U$139  47.19,13.09 270 bottom
U$140  106.88,46.11 90 top
U$141  104.34,46.11 90 top
U$142  101.8,46.11 90 top
U$143  99.26,46.11 90 top
U$144  96.72,46.11 90 top
U$145  94.18,46.11 90 top
U$146  91.64,46.11 90 top
U$147  89.1,46.11 90 top
U$148  101.8,35.95 180 top
U$149  114.12,37.47 0 top
U$150  52.27,65.16 135 top
U$151  24.33,2.93 0 bottom
U$152  31.19,36.33 0 top
X2  84.02,52.46 270 top
X5  15.44,56.27 90 top
Y1  106.88,56.27 270 bottom
Y3  38.3,47.38 135 top

### Tracks (layer width: path | path; a pad name or v marks a point on that pad's centre or on a via)
+3V3  (via drill 0.35)
  Top 0.406: v68.4,26.8 72.59,22.61 ESP32.1
  Bottom 0.203: U$4.P$2 64.65,24.58 Q2.1 65.57,28.24 65.65,28.33 66.88,28.33 | U$2.P$2 72.21,27.27 Q1.1 71.27,28.33 66.88,28.33 | 66.88,28.33 v68.4,26.8
  Bottom 0.406: U$82.P$1 64.97,37.49 | 64.97,37.49 66.28,37.49 U1.3 | 64.97,37.49 64.97,28.83 65.57,28.24 66.96,28.24 v68.4,26.8
+5V  (via drill 0.35)
  Top 0.152: U6.80 56.64,56.22 56.26,55.83 54.58,55.83 52.03,53.28 52.02,53.29 51.99,53.32 | v30.73,21.93 32.33,21.93 U$105.P$2 | U$130.P$2 85.06,66.43 86.97,64.52 89.86,64.52 92.68,67.34 103.2,67.34 105.1,69.25 U$134.P$1 | v29.59,4.78 v25.55,4.78 | U$149.P$1 115.09,36.02 115.09,43.34 109.14,49.28 109.14,49.89 U$107.P$3 | 42.82,62.01 v42.7,62.01 42.82,61.88 42.82,61.49
  Top 0.203: U$81.P$1 59,29.71 U$79.P$2
  Top 0.254: U6.31 39.7,49.92 28.41,49.92 U$1.P$1 | U6.10 42.82,61.49 42.82,62.01 U$6.P$2 43.77,64.28 46.99,64.28 47.87,63.39 U6.100 | v71.32,39.76 71.32,43.15 57.62,56.85 57.36,56.85 56.83,56.32 U6.80 56.7,56.32 56.16,55.79 54.46,55.79 51.99,53.32 v51.26,53.32 | 52.02,53.29 51.94,53.21 51.94,48.83 U6.61
  Top 0.406: +5V_IN.2 U$132.P$1 16.71,49.65 14.44,47.38 | +5V_IN.2 U$1.P$1 | +5V_IN.2 +5V_IN.1 | U$81.P$1 56.07,34.53 U$93.P$1 | LINE.1 14.44,40.96 14.44,47.38 | 14.44,47.38 14.44,59.68 15.44,60.69 X5.1 15.44,76.11 20.02,80.68 MD_L.1 23.58,80.68 34.13,91.24 48.66,91.24 | 48.66,91.24 50.61,89.29 IR.1 | 48.66,91.24 59.21,91.24 MD_R.1 67.26,83.19 70.84,83.19 76.25,77.78 96.8,77.78 U$134.P$1 | J3.1 24.5,8.01 28.63,8.01 29.11,7.53 29.72,7.53 30.78,8.59 30.78,9.25 v30.81,9.28 | v61.54,76.84 61.48,76.9 U$13.VIN 58.62,74.05 U$14.P$15 U$14.P$16
  Bottom 0.152: U$139.P$1 47.19,13.92 41.93,13.92 40.71,12.71 34.39,12.71 33.48,11.79 30.96,11.79 30.81,11.69 | v30.73,21.93 29.59,20.78 29.41,20.71 | v25.55,4.78 24.56,5.77 21.82,5.77 U$46.P$7 | v29.59,4.78 31.34,6.53 31.34,8.67 30.88,9.12 v30.81,9.28 | v42.7,62.01 42.77,61.93
  Bottom 0.203: U$5.P$2 70.05,32.14 71.06,33.15 | 71.06,33.15 U1.1 | U$3.P$2 72.82,32.14 72.06,32.9 71.31,32.9 71.06,33.15
  Bottom 0.254: v71.32,39.76 71.32,37.97 U1.1 | U$1.P$1 28.56,50.07 30.48,50.07 38.66,58.24 38.66,58.61 41.5,61.45 41.5,61.52 41.89,61.9 42.59,61.9 v42.7,62.01 42.82,61.88 42.82,60.97 42.77,60.92 42.77,59.38 44.51,57.64 44.55,57.64 48.87,53.32 51.23,53.32 51.26,53.35 v51.26,53.32
  Bottom 0.406: U2.18 95.13,56.98 95.86,56.98 96.49,57.61 101.8,57.61 | 101.8,57.61 U2.6 | 101.8,57.61 102.46,58.26 102.46,58.83 102.83,59.21 U2.4 106.95,59.21 U$106.P$3 | U$134.P$1 107.88,66.7 U$7.P$1 107.88,62.56 U$106.P$3 | U$93.P$1 60.02,38.49 65.42,38.49 65.94,39.01 69.76,39.01 U1.1 | U$1.P$1 26.87,48.38 26.87,23.25 29.41,20.71 29.41,13.09 30.81,11.69 v30.81,9.28 | U$106.P$3 U$107.P$3 | v61.54,76.84 61.54,78.29 MD_R.1
A7
  Top 0.152: U6.90 53.14,59.8 47.34,54.01 35.84,54.01 35,54.84 34.54,54.84 33.4,55.99 16.18,55.99 15.49,55.3 X5.4
A8  (via drill 0.35)
  Top 0.152: v40.26,53.4 47.27,53.4 53.36,59.49 53.52,59.49 U6.89 | v35.15,53.32 15.49,53.32 X5.5
  Bottom 0.152: v40.26,53.4 35.23,53.4 v35.15,53.32
A9
  Top 0.203: X2.7 79.38,58.46 79.07,58.15 60.55,58.15 57.9,60.8 55.56,60.8 53.91,59.15 U6.88
A10
  Top 0.203: X2.6 80.15,56.46 78.94,57.66 60.4,57.66 57.73,60.33 55.77,60.33 U6.87
A11
  Top 0.203: X2.5 81.51,54.46 78.66,57.31 60.25,57.31 57.59,59.97 56.12,59.97 U6.86
A12
  Top 0.203: X2.4 82.75,52.46 78.31,56.9 60.16,56.9 57.55,59.51 56.37,59.51 U6.85
A14
  Top 0.203: U6.83 56.41,58.14 58.27,58.14 59.89,56.52 78.06,56.52 84.02,50.56 X2.3
D2  (via drill 0.35)
  Top 0.152: v46.51,60.56 45.52,61.55 U6.6
  Bottom 0.152: v46.51,60.56 48.56,60.56 49.33,59.8 54.35,59.8 72.49,77.93 MD_R.5
D2_328  (via drill 0.35)
  Top 0.152: U$135.P$1 50.62,34.35 50.47,34.5 v50.47,37.47 | v88.11,63.91 89.71,63.91 91.16,65.36 v100.53,65.36
  Bottom 0.152: v50.47,37.47 50.93,37.47 63.12,49.66 73.86,49.66 v88.11,63.91 | v100.53,65.36 100.53,65.21 102.06,63.68 102.06,63.15 U2.32
D3_328  (via drill 0.35)
  Top 0.152: v63.42,30.31 66.39,30.31 v73.1,37.01 | v74.62,38.54 74.62,42.35 79.81,47.53 84.38,47.53 88.72,51.87 88.72,62.46 91.16,64.9 100.07,64.9 100.23,64.75 v101.9,64.75
  Bottom 0.152: v63.42,30.31 52.6,30.31 52.14,29.85 52.14,28.56 52.91,27.79 52.91,26.8 40.87,14.76 40.87,14 U$138.P$1 | v74.62,38.54 v73.1,37.01 | v101.9,64.75 103.5,63.15 103.5,61.63 U2.1
D4_328  (via drill 0.35)
  Top 0.152: v101.45,60.71 101.06,60.71 99.08,62.69 92.68,62.69 92.38,63 v91.08,63 | v49.78,20.63 v49.78,36.33 | U$137.1 38.43,10.65 50.85,10.65 U$137.2
  Bottom 0.152: 49.36,12.13 50.85,10.65 U$137.2 | 49.36,12.13 49.33,12.17 47.19,12.17 U$139.P$2 | v101.45,60.71 101.52,60.79 103.5,60.79 U2.2 | v91.08,63 91.08,62.54 84.91,56.37 84.91,56.06 84.22,55.38 82.55,55.38 76.53,49.36 63.27,49.36 50.24,36.33 v49.78,36.33 | v49.78,20.63 49.78,16.13 49.4,15.75 49.4,12.17 49.36,12.13
D5  (via drill 0.35)
  Top 0.152: v44.22,63.61 45.82,62.01 U6.5
  Bottom 0.152: v44.22,63.61 44.22,88.3 43.23,89.29 IR.5
D5_328  (via drill 0.35)
  Top 0.203: U$140.P$1 v106.88,43.57
  Bottom 0.203: v106.88,43.57 106.88,49.69 U2.9
D6  (via drill 0.35)
  Top 0.152: v42.85,57.13 42.85,57.82 42.39,58.27 42.39,58.43 U6.15 | v42.85,41.51 42.39,41.51 29.59,28.71 23.8,28.71 LINE.5
  Bottom 0.152: v42.85,41.51 v42.85,57.13
D6_328  (via drill 0.35)
  Top 0.203: U$141.P$1 v104.34,43.57
  Bottom 0.203: U2.10 101.28,54.49 101.28,53.91 104.34,50.84 v104.34,43.57
D7
  Top 0.152: U6.16 41.93,58.12 41.78,58.12 35.53,64.37 28.29,64.37 17.7,74.96 MD_L.5
D7_328  (via drill 0.35)
  Top 0.203: U$142.P$1 v101.8,43.57
  Bottom 0.203: U2.11 100.48,54.49 100.48,53.91 101.8,52.58 v101.8,43.57
D8_328  (via drill 0.35)
  Top 0.203: U$143.P$1 v99.26,43.57
  Bottom 0.203: v99.26,43.57 99.26,53.01 99.64,53.4 99.64,54.49 U2.12
D9_328  (via drill 0.35)
  Top 0.203: U$144.P$1 v96.72,43.57
  Bottom 0.203: U2.13 98.84,54.49 98.84,53.52 96.72,51.4 v96.72,43.57
D10  (via drill 0.35)
  Top 0.152: v50.47,58.04 50.47,57.66 47.24,54.44 40.74,54.44 39.57,55.61 U6.23
  Top 0.203: v89.1,65.16 88.99,65.16 88.1,66.05 U$131.P$1 86.43,66.17 U$130.P$1 82.95,69.66 328_RESET.1 328_RESET.2
  Bottom 0.152: v50.47,58.04 80.41,58.04 87.5,65.13 89.03,65.13 v89.1,65.16
  Bottom 0.203: U2.29 99.39,63.38 99.39,63.96 98.2,65.16 v89.1,65.16
D10_328  (via drill 0.35)
  Top 0.203: U$145.P$1 v94.18,43.57
  Bottom 0.203: v94.18,43.57 94.18,49.92 98.06,53.8 U2.14
D11  (via drill 0.35)
  Top 0.152: v35,55.76 38.5,55.76 38.96,55.3 39.11,55.3 U6.24
  Bottom 0.152: v35,55.76 34.39,55.76 29.06,50.42 25.86,50.42 22.2,46.77 19.99,46.77 15.49,51.26 X5.6
D11_328  (via drill 0.35)
  Top 0.203: U$146.P$1 v91.64,43.57
  Bottom 0.203: v91.64,43.57 91.64,48.3 97.26,53.92 U2.15
D12
  Top 0.152: U6.25 38.73,54.92 35.38,54.92 35.15,55.15 34.69,55.15 32.64,57.21 15.49,57.21 X5.3
D12_328  (via drill 0.35)
  Top 0.203: U$147.P$1 v89.1,43.57
  Bottom 0.203: v89.1,43.57 89.1,47.15 U2.16
D22  (via drill 0.35)
  Top 0.152: v73.1,39.15 70.58,39.15 69.59,40.14 69.59,41.66 57.86,53.4 57.78,53.4 56.87,54.31 56.87,54.92 57.4,55.45 57.4,55.61 U6.78
  Top 0.203: U$122.P$2 119.12,38.06 U$149.P$3
  Bottom 0.152: v73.1,39.15 83.16,39.15 87.5,34.8 98.47,34.8 98.93,35.26 114.32,35.26 114.4,35.18 118.29,35.18 119.05,35.95 U$149.P$3
D23  (via drill 0.35)
  Top 0.152: v70.2,40.44 70.2,41.51 58.01,53.7 57.94,53.7 57.25,54.39 57.25,54.62 57.71,55.07 57.71,55.23 U6.77 | v86.82,40.67 91.69,40.67 98.93,33.43 118.51,33.43 121.03,35.95 U$149.P$4
  Top 0.203: U$121.P$2 121.12,38.6 U$149.P$4
  Bottom 0.152: v70.2,40.44 70.66,40.44 70.89,40.67 v86.82,40.67
D24  (via drill 0.35)
  Top 0.152: v65.17,47.83 58.16,54.84 U6.76 | v76.76,43.57 79.2,43.57 89.63,33.13 120.34,33.13 123.09,35.87 U$149.P$5
  Top 0.203: U$120.P$2 123.39,36.24 U$149.P$5
  Bottom 0.152: v65.17,47.83 66.01,47.83 66.32,48.14 72.19,48.14 v76.76,43.57
D25  (via drill 0.35)
  Top 0.152: v56.41,53.85 56.79,53.85 58.09,52.56 U6.75 | v78.97,53.85 v76.22,53.85 | v82.62,57.51 84.38,57.51 84.91,58.04 84.91,64.83 82.24,67.49 v82.24,71.61
  Top 0.203: U$119.P$2 122.88,73.73 U$149.P$6
  Bottom 0.152: v76.22,53.85 v56.41,53.85 | v82.62,57.51 v78.97,53.85 | v82.24,71.61 82.47,71.61 87.12,76.26 117.98,76.26 120.27,73.97 120.27,73.67 120.8,73.13 122.25,73.13 123.09,73.97 U$149.P$6
D26  (via drill 0.35)
  Top 0.152: v58.93,51.42 58.7,51.42 57.94,52.18 57.78,52.18 U6.74 | v82.4,59.11 82.4,66.88 81.63,67.65 81.63,71.91 v82.24,72.52
  Top 0.203: U$118.P$2 120.85,73.7 U$149.P$7
  Bottom 0.152: v58.93,51.42 74.7,51.42 v82.4,59.11 | v82.24,72.52 82.93,72.52 86.97,76.56 118.59,76.56 121.11,74.05 U$149.P$7
D27  (via drill 0.35)
  Top 0.152: v56.72,52.94 56.72,52.71 57.4,52.02 57.4,51.87 U6.73 | v79.2,52.94 v75.31,52.94 | v91.46,64.29 101.45,64.29 101.6,64.14 111.28,64.14 118.21,71.07 118.9,71.07 U$117.P$2
  Top 0.203: U$117.P$2 118.95,73.8 U$149.P$8
  Bottom 0.152: v75.31,52.94 v56.72,52.94 | v79.2,52.94 83.77,57.51 84.68,57.51 v91.46,64.29
D30  (via drill 0.35)
  Top 0.203: v55.09,28.58 55.22,28.71 55.22,44.7 52.82,47.09 U6.60
  Bottom 0.203: U$112.P$1 57.86,2.93 54.81,5.97 54.81,28.3 v55.09,28.58
D31  (via drill 0.35)
  Top 0.203: v54.04,29.6 54.04,31.3 54.86,32.11 54.86,44.5 U6.59
  Bottom 0.203: U$113.P$1 52.27,2.93 54.46,5.11 54.46,28.55 54.04,28.96 v54.04,29.6
D32  (via drill 0.35)
  Top 0.203: v53.49,28.64 53.41,28.72 53.41,29.86 52.67,30.6 52.67,45.83 52.12,46.39 U6.58
  Bottom 0.203: U$114.P$1 44.65,2.93 45.92,4.2 52.27,4.2 54.05,5.97 54.05,28.08 v53.49,28.64
D33  (via drill 0.35)
  Top 0.203: U6.57 51.76,46.03 52.32,45.48 52.32,30.06 v52.78,29.6
  Bottom 0.203: U$115.P$1 38.3,2.93 39.93,4.55 52.12,4.55 53.67,6.1 53.67,27.56 52.78,28.45 v52.78,29.6
D35  (via drill 0.35)
  Top 0.152: U6.55 51.08,45.47 50.58,45.97 50.58,46.1 50.47,46 50.47,54.21 v49.71,54.97 | v40.94,55.1 40.96,55.07 46.89,55.07 48.18,56.37 v48.31,56.37 | v37.03,57.54 38.3,57.54 v38.59,57.25 | v38.3,67.7 43.03,67.7 43.36,68.02 43.86,68.02 44.11,67.77 59.89,67.77 62.43,70.31 62.43,77.86 U$13.DIN
  Bottom 0.152: v48.31,56.37 49.69,55 49.73,55 v49.71,54.97 | v38.59,57.25 38.79,57.25 v40.94,55.1 | v37.03,57.54 37.03,66.43 v38.3,67.7
D37  (via drill 0.35)
  Top 0.152: v50.85,38.77 50.85,44.1 50.39,44.56 50.39,44.71 U6.53 | v114.78,44.56 118.13,44.56 118.67,45.09 118.67,53.73
  Top 0.203: U$109.P$2 113.57,58.85 U$106.P$2 115.77,62.33 115.77,63.17 116.4,63.79 117.69,63.79 117.84,63.64 117.84,63.09 118.67,62.26 118.67,53.73
  Bottom 0.152: v50.85,38.77 47.88,35.79 47.88,34.57 48.49,33.97 54.28,33.97 55.5,35.18 55.5,35.72 58.7,38.92 65.17,38.92 66.09,39.83 70.51,39.83 71.04,40.37 86.21,40.37 86.51,40.06 87.5,40.06 90.09,42.65 112.88,42.65 v114.78,44.56
  Bottom 0.203: U$10.P$2 113.52,58.81 113.48,58.85 U$106.P$2
D39  (via drill 0.35)
  Top 0.152: v60.07,50.27 57.02,50.27 56.56,50.73 56.41,50.73 U6.70 | v73.1,44.1 v66.93,50.27
  Top 0.203: U$107.P$2 113.57,47.42 U$111.P$2
  Bottom 0.152: v66.93,50.27 v60.07,50.27 | v73.1,44.1 75.31,44.1 76.45,42.96 107.77,42.96 112.19,47.38 U$107.P$2
  Bottom 0.203: U$107.P$2 U$11.P$2
D41
  Top 0.152: U$9.P$3 33.25,13.09 34.31,14.15 34.31,18.57 34.16,18.73 34.16,21.93 U$105.P$1 34.16,22 36.14,22 47.34,33.2 47.34,34.8 49.63,37.09 49.63,44.02 U6.51
D58
  Top 0.152: MD_L.3 31.57,66.81 51.53,66.81 53.74,64.6 53.74,62.69 52.14,61.09 52.14,60.94 U6.93
ESP_RX
  Bottom 0.203: Q1.2 70.37,24.58 U$2.P$1 73.5,21.45 73.5,12.71 72.59,11.81 ESP32.4
ESP_TX
  Bottom 0.203: Q2.2 62.81,27.27 U$4.P$1 62.81,23.59 72.59,13.81 ESP32.3
GND  (via drill 0.35)  (2 unrouted)
  Top 0.152: 73.86,38.54 63.12,38.54 53.74,47.91 53.59,47.91 U6.62 | J3.S4 21.82,5.24 23.04,5.24 23.95,6.15 J3.S2 | J3.S1 23.95,12.4 23.04,13.32 21.82,13.32 J3.S3 21.74,13.39 21.74,15.3 20.83,16.21 20.83,33.74 LINE.2 | U$80.P$4 57.4,19.33 57.35,19.33 | U$122.P$1 118.29,40.59 118.29,39.99 117.14,38.84 117.14,36.02 U$149.P$2 | U6.11 43.84,59.8 44.3,59.34 46.28,59.34 49.93,63 U6.99 | 125.91,60.03 122.93,63 122.93,69.32 U$119.P$1 | v42.16,61.24 42.24,61.24 42.3,61.3 | 54.81,88.02 54.81,82.94 U$13.GND
  Top 0.203: U$122.P$1 U$121.P$1 U$120.P$1 | U$117.P$1 U$118.P$1 U$119.P$1
  Top 0.254: U6.32 40.8,50.42 39.89,49.51 35.76,49.51 | 35.76,49.51 31.55,49.51 29.68,47.65 U$1.P$2 | U6.11 42.3,61.3 41.69,61.91 U$6.P$1 | U6.99 51.56,64.61 U$150.P$2 | U6.81 56.47,56.68 57.11,57.31 57.84,57.31 | J3.5 24.14,10.9 J3.S1 | 21.79,8.9 J3.S6 | 35.76,49.51 36.36,48.91 36.36,47.58 36.81,47.13 37.04,47.13 37.28,47.38 Y3.2
  Top 0.406: +5V_IN.3 +5V_IN.4 21.79,34.87 LINE.2 | +5V_IN.3 U$132.P$2 | +5V_IN.3 U$1.P$2 | U$93.P$2 53.92,32.79 U$81.P$2 | X5.2 15.44,59.46 16.45,60.47 16.45,76.32 19.4,79.27 MD_L.2 21.95,79.28 23.62,79.28 34.9,90.56 48.46,90.56 49.19,89.83 IR.2 50.46,88.02 54.81,88.02 61.01,88.02 66.7,82.32 68.13,82.32 MD_R.2 70.58,82.18 76.17,76.59 83.36,76.59 328_RESET.4 328_RESET.3 85.1,71.31 85.29,71.51 92.91,71.51 U$134.P$5 | 57.84,57.31 59.09,56.06 77.87,56.06 83.02,50.92 83.02,50.04 84.02,49.03 X2.2 77.48,48.46 v73.86,44.84 73.86,38.54 73.86,16.36 | 73.86,16.36 ESP32.2 | U$137.4 50.9,15.63 | 50.9,15.63 50.9,15.73 U$137.- 49.73,19.44 57.35,19.44 57.35,19.33 57.35,6.88 U$80.P$1 60.03,4.2 71.43,4.2 73.97,6.74 73.97,16.25 73.86,16.36 | 50.9,15.63 38.44,15.63 U$137.3 33.36,10.55 U$9.P$2 | U$9.P$2 31.95,9.28 31.95,8.01 v30.68,6.74 30.12,6.18 J3.S2 | J3.S1 25.94,10.58 | U$9.P$2 25.97,10.55 25.94,10.58 | J3.5 25.94,10.58
  Bottom 0.152: U$61.P$1 25.4,10.5 25.4,9.2 26.85,7.75 26.85,7.37 27.3,6.91 27.61,6.91 U$46.P$3 | 117.09,36 U$149.P$2 | U$148.P$3 101.83,37.55 115.47,37.55 115.5,37.58 | 115.39,46.16 113.22,48.33 113.18,48.37 | U$133.P$2 91.69,59.8 93.75,59.8 94.21,59.34 94.82,59.34 U2.21 | 124.74,58.81 U$10.P$1 | 111.14,66.87 107.85,70.16 104.49,70.16 104.42,70.08 104.42,68.56 104.04,68.18 104.04,66.73 103.9,66.6 | 28.14,47.68 U$1.P$2
  Bottom 0.203: Y1.2 107.63,55.52 107.94,55.52 108.16,55.3 108.16,49.53 108.71,48.98 112.56,48.98 113.18,48.37
  Bottom 0.254: v42.16,61.24 41.3,60.38 41.28,60.38 39.75,58.85 39.75,57.46 41.8,55.41 41.8,54.01 40.45,52.66 33.65,52.66 28.67,47.68 28.14,47.68
  Bottom 0.406: Y1.2 107.53,56.91 107.98,56.91 108.19,57.12 108.19,57.81 107.59,58.41 U2.5 | U2.21 102.03,59.21 102.66,59.84 103.39,59.84 U2.3 103.73,60.18 104.46,60.18 105.88,61.6 U$7.P$2 105.88,64.62 103.9,66.6 97.82,66.6 U$134.P$5 96.12,68.97 97.44,70.29 107.72,70.29 111.14,66.87 111.14,63.06 U$10.P$1 113.33,56.74 113.33,51.99 113.22,51.88 113.22,48.33 | U1.2 69.2,44.84 v73.86,44.84 | U1.2 63.41,44.42 U$93.P$2 | U$82.P$2 67.51,43.3 67.51,43.57 68.36,44.42 U1.2 | U$46.P$3 30.64,6.78 v30.68,6.74 | +5V_IN.3 16.45,52.99 16.45,57.68 15.44,58.69 X5.2 | 113.18,48.37 115.39,46.16 U$11.P$1 115.39,44.99 115.51,44.86 115.51,44.25 115.5,44.24 115.5,37.58 115.54,37.55 | 115.82,37.27 | 115.82,37.27 117.09,36 | 115.82,37.27 115.54,37.55 | 115.54,37.55 101.83,37.55
  other vias: 67.51,6.74 63.7,43.57 75.13,33.41 103.07,41.03 127.2,42.3 128.47,62.62 86.56,67.7 67.51,55 63.7,77.86 45.92,79.13 38.3,80.4 20.52,68.97 12.9,67.7 25.6,61.35 24.33,55 30.68,43.57 11.63,47.38 29.41,27.06 26.87,14.36 37.03,5.47 21.79,2.93 26.87,2.93 59.89,2.93 64.97,63.89 78.94,63.89 56.08,65.16 38.3,63.89 54.81,52.46 47.19,51.19 57.35,47.38 39.57,44.84 47.19,38.49 53.54,42.3 61.16,34.68 57.35,27.06 43.38,21.98 37.03,27.06 44.65,11.82 66.24,13.09 92.91,41.03 81.48,46.11 91.64,55 97.99,56.27 97.99,60.08 106.88,61.35 110.69,61.35 114.5,56.27 105.61,53.73 110.69,53.73 120.85,51.19 89.99,52.58 110.31,67.82 97.99,49.92 100.53,49.92 114.63,49.92 48.59,93.1 68.91,85.48 109.55,75.32 25.98,51.82
  pour Top: -3.61,109.61 -3.61,89.29 -18.85,74.05 -18.85,33.41 21.79,-7.23 90.37,-7.23 92.91,-4.69 104.34,-4.69 160.22,51.19 160.22,76.59 131.01,105.8 127.2,109.61
  pour Bottom: -7.42,129.93 -20.12,117.23 -20.12,-4.69 -9.96,-14.85 114.5,-14.85 181.81,52.46 181.81,77.86 129.74,129.93
LEVEL_RX
  Bottom 0.152: Q1.3 71.35,29.24 71.58,29.24 73.86,26.95 73.86,11.11 72.79,10.04 62.81,10.04 58.77,6 58.77,2.34 58.62,2.19 28.98,2.19 26.16,5.01 26.16,7.98 24.79,9.35 24.79,14.53 26.77,16.52 U$8.P$1
  Bottom 0.203: U$3.P$1 71.7,29.98 71.32,29.6 Q1.3
LEVEL_TX  (via drill 0.35)
  Top 0.152: v46.73,33.51 40.49,33.51 26.85,19.87 U$8.P$6
  Bottom 0.152: v46.73,33.51 48.03,32.21 64.03,32.21 U$5.P$1
  Bottom 0.203: U$5.P$1 64.08,29.71 Q2.3
N$1
  Top 0.406: U$12.P$2 36.34,77.86 U$13.VO2
N$2  (via drill 0.35)
  Top 0.254: J3.2 28.92,8.63 29.28,8.26 v29.41,8.26
  Bottom 0.254: v29.41,8.26 28.93,7.78 U$46.P$2
N$3  (via drill 0.35)
  Top 0.254: J3.3 v29.41,9.28
  Bottom 0.254: v29.41,9.28 28.91,8.78 U$46.P$1
N$4
  Bottom 0.254: U$46.P$10 21.74,8.96 U$61.P$2
N$5  (via drill 0.35)
  Top 0.152: v50.62,20.17 50.62,21.93 JYRO.K 50.62,22 50.62,24.67 51.61,25.66 51.61,27.26 52.07,27.72 53.44,27.72 58.7,22.46 59.31,22.46 60.3,23.45 60.3,23.91 65.02,28.63 v73.1,28.63 | v50.62,17.58 52.07,16.13 52.07,4.32 50.7,2.95 D31.K | LED8.K 93.52,54.39 93.5,54.37 | 99.94,54.37 99.92,54.39 LED6.K | LED10.K 93.6,60.79 93.59,60.79 | LED4.K 99.92,60.79 99.89,60.75 | 95.45,46.46 107.47,46.46 108.15,47.15 108.15,50.27 108.91,51.03 116.53,51.03 116.99,51.49 LED13.K
  Top 0.203: 94.17,53.71 94.54,53.33 LED7.K 98.9,53.33 LED6.K 99.94,54.37 100.93,55.36 LED5.K 100.93,59.71 LED4.K 99.89,60.75 98.9,61.74 LED3.K 94.54,61.74 93.59,60.79 LED10.K 92.52,59.71 LED9.K 92.52,55.36 93.5,54.37 LED8.K 94.17,53.71 | U$148.P$2 95.45,38.2 95.45,46.46 95.45,52.46 94.2,53.71 94.17,53.71 | LED12.K 118.31,45.22 118.31,50.31 | 118.31,50.31 LED13.K | 118.31,50.31 118.31,56.66 | LED11.K 118.31,61.74 118.31,56.66 | 118.31,56.66 LED1.K | D33.K 36.64,1.66 42.11,1.66 | D30.K 56.96,1.66 49.73,1.66 | 42.11,1.66 49.73,1.66 | D31.K 50.61,2.53 49.73,1.66 | D32.K 42.99,2.53 42.11,1.66
  Bottom 0.152: v50.62,17.58 v50.62,20.17 | v73.1,28.63 75.23,28.63 80.95,34.35 99.24,34.35 U$148.P$2
N$6
  Top 0.203: U$111.P$1 117.03,48.27 LED12.A
N$7
  Top 0.203: U$110.P$1 117.03,53.35 LED13.A
N$8
  Top 0.203: U$107.P$1 113.65,52.42 U$110.P$2
N$9
  Top 0.203: U$106.P$1 113.65,63.85 U$108.P$1
N$10
  Top 0.203: U$108.P$2 117.03,64.78 LED11.A
N$11
  Top 0.203: U$109.P$1 117.03,59.7 LED1.A
N$12
  Top 0.406: U$12.P$1 40.26,75.32 U$13.VO1
N$13
  Top 0.406: U$14.P$1 45.92,82.03 46.83,82.94 U$13.EN2
N$14
  Top 0.406: U$14.P$2 51,81.67 U$13.EN1
N$65  (via drill 0.35)
  Top 0.203: D30.A v54.81,2.93
  Bottom 0.203: v54.81,2.93 U$112.P$2
N$66  (via drill 0.35)
  Top 0.203: D31.A 48.84,2.94 v46.56,2.94
  Bottom 0.203: U$113.P$2 46.57,2.93 v46.56,2.94
N$67  (via drill 0.35)
  Top 0.203: D32.A 39.32,2.93 v39.32,2.94
  Bottom 0.203: v39.32,2.94 39.34,2.93 U$114.P$2
N$68  (via drill 0.35)
  Top 0.203: v31.95,2.93 D33.A
  Bottom 0.203: U$115.P$2 v31.95,2.93
N$69
  Bottom 0.152: U$133.P$1 91.69,57.82 93.75,57.82 94.28,58.35 94.89,58.35 U2.20
N$70
  Top 0.203: U$131.P$2 91.63,67.7 96.45,67.7 97.72,68.97 U$134.P$4
N$71
  Bottom 0.203: U$136.P$2 90.75,72.4 92.96,70.19 92.96,68.21 95.03,66.14 98.81,66.14 100.99,63.96 100.99,63.38 U2.31
N$72
  Bottom 0.203: U2.8 104.5,55.07 Y1.3
N$73
  Bottom 0.203: U2.7 106.22,56.81 Y1.1
N$74
  Top 0.152: U$135.P$2 48.87,25.74 48.87,22 JYRO.A
N$75
  Bottom 0.203: U2.30 100.19,63.38 100.19,63.96 98.36,65.79 94.82,65.79 92.51,68.1 92.51,69.96 91.26,71.21 89.02,71.21 U$136.P$5
N$76
  Top 0.203: U$134.P$3 95.45,74.05 88.68,74.05 U$136.P$6
N$77
  Top 0.203: U$136.P$1 91.63,74.4 96.82,74.4 102.26,68.97 U$134.P$2
N$79
  Bottom 0.152: U$138.P$2 40.87,12.17 40.87,8.06 U$137.+
N$80
  Top 0.203: LED3.A 100.73,63.49 104.24,59.98 107.87,59.98 108.91,58.93 108.91,53.98 106.88,51.95 U$140.P$2
N$81
  Top 0.152: LED4.A
  Top 0.203: U$141.P$2 104.34,49.92 108.53,54.11 108.53,58.81 107.72,59.62 103.49,59.62 LED4.A
N$82
  Top 0.203: U$142.P$2 102.68,47.87 102.68,53.73 101.8,54.6 101.8,56.27 102.68,57.14 LED5.A
N$83
  Top 0.203: U$143.P$2 99.26,51.22 LED6.A | LED6.A
N$84
  Top 0.203: U$144.P$2 LED7.A
N$85
  Top 0.203: U$145.P$2 94.18,51.22 LED8.A | LED8.A
N$86
  Top 0.203: U$146.P$2 90.77,47.87 LED9.A
N$87
  Top 0.203: U$147.P$2 89.1,58.77 LED10.A | LED10.A
N$89
  Top 0.152: U$150.P$1 52.91,64.45 52.14,64.45 50.39,62.69 U6.98
N$90
  Bottom 0.254: U$46.P$6 23.33,3.19 U$151.P$2
RES  (via drill 0.35)
  Top 0.203: U6.30 39.38,50.3 34.77,50.3 v34.49,50.57 | v52.27,27.06 57.35,21.98 61.16,21.98 | 61.16,21.98 62.39,20.75 U$80.P$3 U$80.P$2 | 61.16,21.98 61.16,22.87 U$79.P$1
  Bottom 0.203: v52.27,27.06 44.7,34.63 44.7,35.32 34.49,45.52 v34.49,50.57
  Bottom 0.254: U$80.P$2 62.39,2.37 61.16,1.14 26.87,1.14 25.33,2.68 U$151.P$1
RX0  (via drill 0.35)
  Top 0.152: v47.8,62.08 47.8,62.16 46.96,63 U6.2 | v42.01,63.91 40.94,64.98 v28.67,64.98
  Bottom 0.152: v47.8,62.08 43.84,62.08 v42.01,63.91 | v28.67,64.98 20.83,64.98 16.03,60.18 15.04,60.18 14.5,59.64 14.5,34.65 25.25,23.91 25.25,17.51 24.33,16.59 U$8.P$2
RX1
  Top 0.203: LINE.3 31.82,32.14 U6.45
RX2  (via drill 0.35)
  Top 0.203: U6.12 43.54,59.5 44.05,59 46.75,59 v46.94,58.81
  Bottom 0.203: v46.94,58.81 47.06,58.68 68.99,58.68 79.58,69.26 89.74,69.26 U$136.P$3
RX3  (via drill 0.35)
  Top 0.152: v52.6,52.94 52.6,49.74 53.82,48.52 53.82,48.37 U6.63 | v47.5,58.04 47.5,58.5 48.94,59.95 v48.94,61.09
  Bottom 0.152: v47.5,58.04 v52.6,52.94 | v48.94,61.09 48.94,87.53 IR.3
SCL  (via drill 0.35)
  Top 0.152: U6.43 44.83,46.54 44.83,46.69 45.29,47.15 45.29,47.45 44.65,48.09 v44.65,48.65 | v57.35,61.43 57.27,61.35 v54.81,61.35 | v50.84,60.4 50.19,59.75 50.19,59.26 46.43,55.5 44.78,55.5 44.65,55.63 v44.65,55.68
  Bottom 0.152: U$149.P$9 117.07,74.05 116.3,74.81 114.78,74.81 114.32,74.35 87.27,74.35 83.92,71 81.35,71 81.28,71.07 79.78,71.07 70.05,61.35 57.35,61.35 v57.35,61.43 | v54.81,61.35 53.57,60.1 51.14,60.1 v50.84,60.4 | v44.65,55.68 v44.65,48.65
SCL_328
  Bottom 0.203: U$93.P$3 51.38,36.33 63.57,48.52 72.72,48.52 77.14,44.1 86.84,44.1 88.19,45.45 88.19,58.66 91.67,62.14 95.82,62.14 95.85,62.1 98.44,62.1 98.59,62.25 98.59,62.84 U2.28
SDA  (via drill 0.35)
  Top 0.152: v42.24,52.79 45.67,49.36 45.67,46.84 45.21,46.39 45.21,46.23 U6.44 | v40.41,58.58 39.14,58.58 v38,59.72 | v43.61,67.42 77.98,67.42 v81.02,70.47
  Bottom 0.152: v42.24,52.79 42.24,56.75 v40.41,58.58 | v38,59.72 38,60.81 43.61,66.43 v43.61,67.42 | v81.02,70.47 83.84,70.47 87.35,73.97 115.09,73.97 U$149.P$10
SDA_328
  Bottom 0.203: U2.27 97.79,63.38 97.79,63.96 97.61,64.14 93.17,64.14 87.83,58.81 87.83,45.73 86.56,44.46 77.48,44.46 72.96,48.98 63.4,48.98 49.35,34.93 U$93.P$4
SS  (via drill 0.35)
  Top 0.152: v49.88,60.53 49.88,59.52 46.89,56.52 41.55,56.52 41.1,56.98 40.94,56.98 U6.19
  Bottom 0.152: v49.88,60.53 49.88,60.97 69.67,80.75 MD_R.3
TX0  (via drill 0.35)
  Top 0.152: v45.59,63.61 46.51,62.69 U6.3 | v44.83,64.98 41.4,64.98 40.79,65.59 v27.99,65.59
  Bottom 0.152: v45.59,63.61 45.59,64.22 v44.83,64.98 | v27.99,65.59 18.08,65.59 14.2,61.7 14.2,34.5 24.33,24.36 U$8.P$5
TX1
  Top 0.203: U6.46 30.8,30.4 LINE.4
TX2  (via drill 0.35)
  Top 0.203: U6.13 43.04,59.02 43.76,58.3 v44.78,58.3
  Bottom 0.203: U$136.P$4 86.94,69.77 79.32,69.77 69.02,59.46 46.58,59.46 45.41,58.3 v44.78,58.3
TX3  (via drill 0.35)
  Top 0.152: v53.21,50.04 53.21,49.81 54.2,48.82 54.2,48.67 U6.64 | v41.55,59.72 41.55,60.94 40.64,61.85 v40.64,64.37 | v40.64,84.79 45.13,89.29 IR.4
  Bottom 0.152: v53.21,50.04 51.23,50.04 v41.55,59.72 | v40.64,84.79 v40.64,64.37
USB_RX
  Bottom 0.254: U$46.P$8 22.15,7.18 22.5,7.18 22.79,7.47 22.79,8.49 24.33,10.04 24.33,11.86 21.83,14.36 U$8.P$3
USB_TX
  Bottom 0.254: U$8.P$4 20.52,18.51 20.52,8.65 20.99,8.18 21.34,8.18 U$46.P$9
XT1
  Top 0.254: U6.34 41.62,49.6 41.09,49.07 41.09,48.47 Y3.1
XT2
  Top 0.254: Y3.3 38.33,49.1 40.19,49.1 41.16,50.07 U6.33

### Text on the board
tPlace: H | USB | L | 1 | 2 | ×0 | L | L | ×1 | L | H | ×2 | H | L | ×3 | H | H | 2560 | Transition | AT | BL | Wireless_Com | ON | OFF | LED_SW | ON | OFF | USB | ESP